# EAGLE board max10adc_v9.02_16chan (EAGLE 9.5.2), part 1 of 3
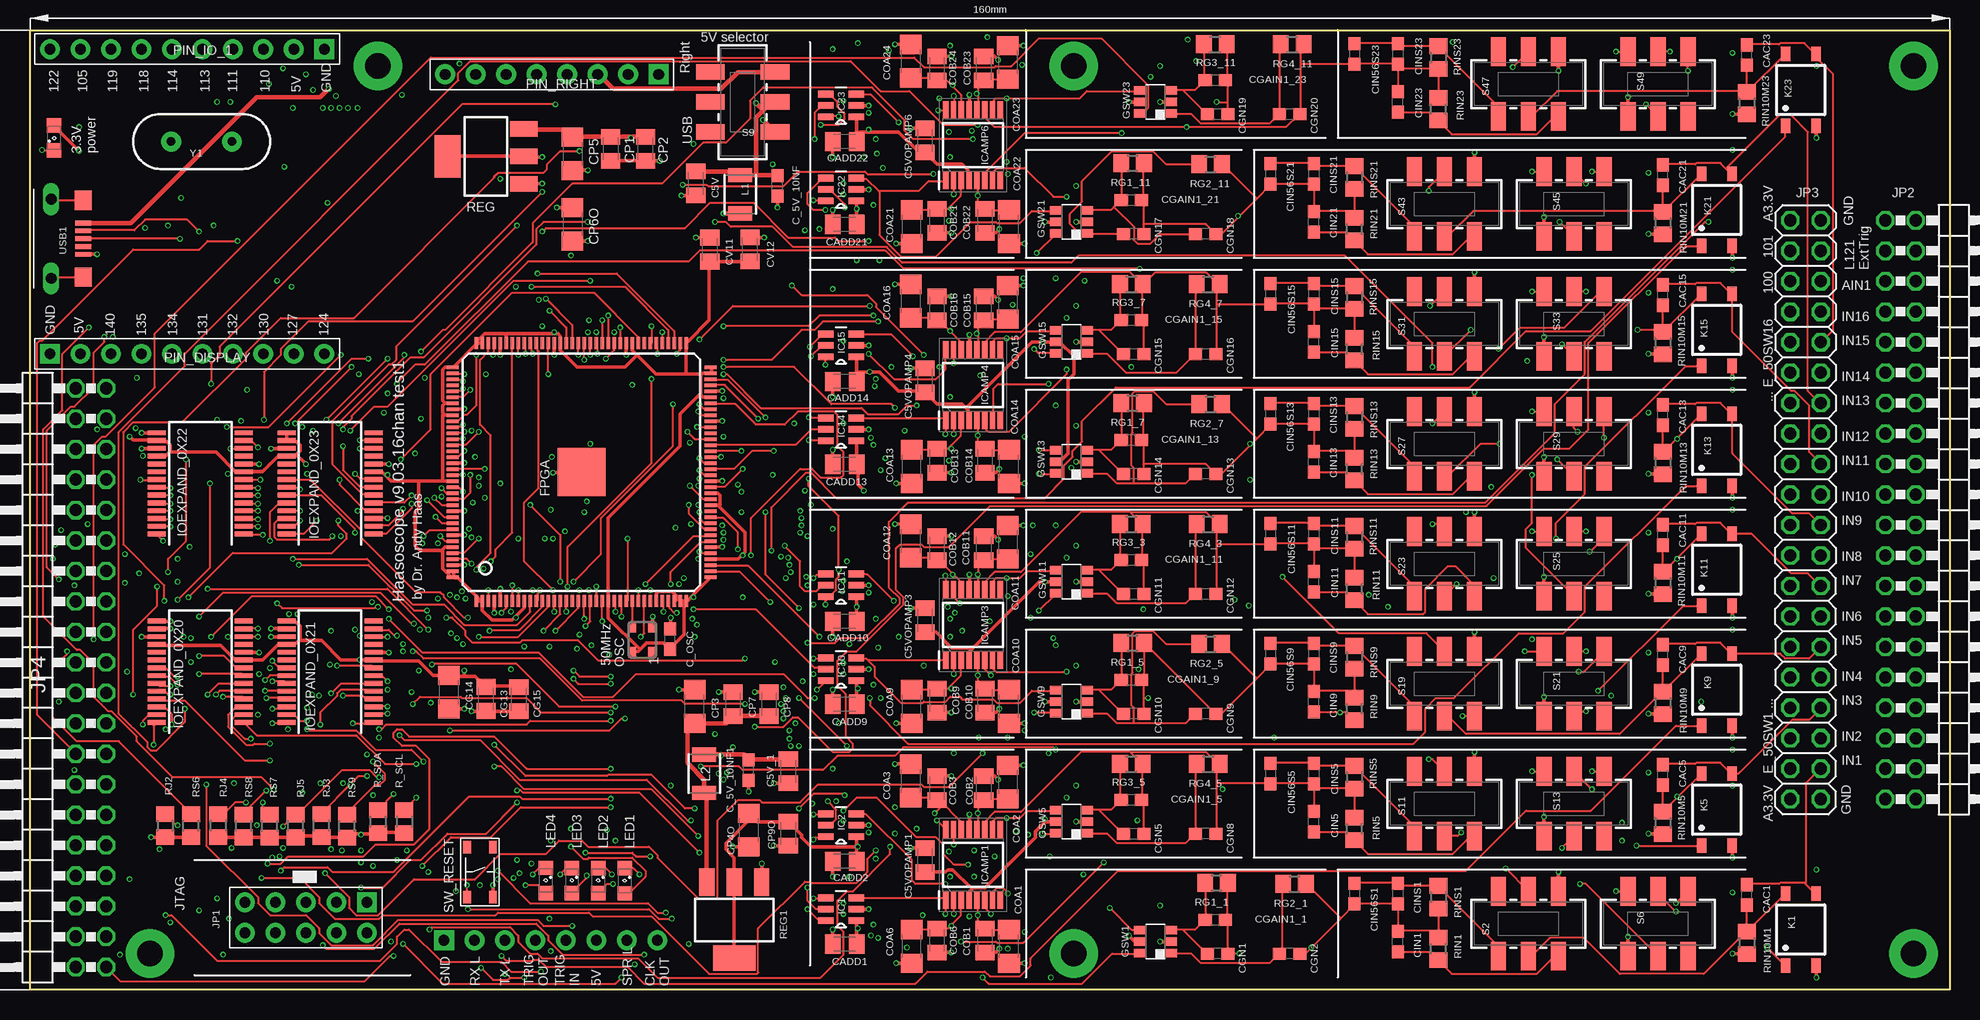
[diagram p6: board, top side]
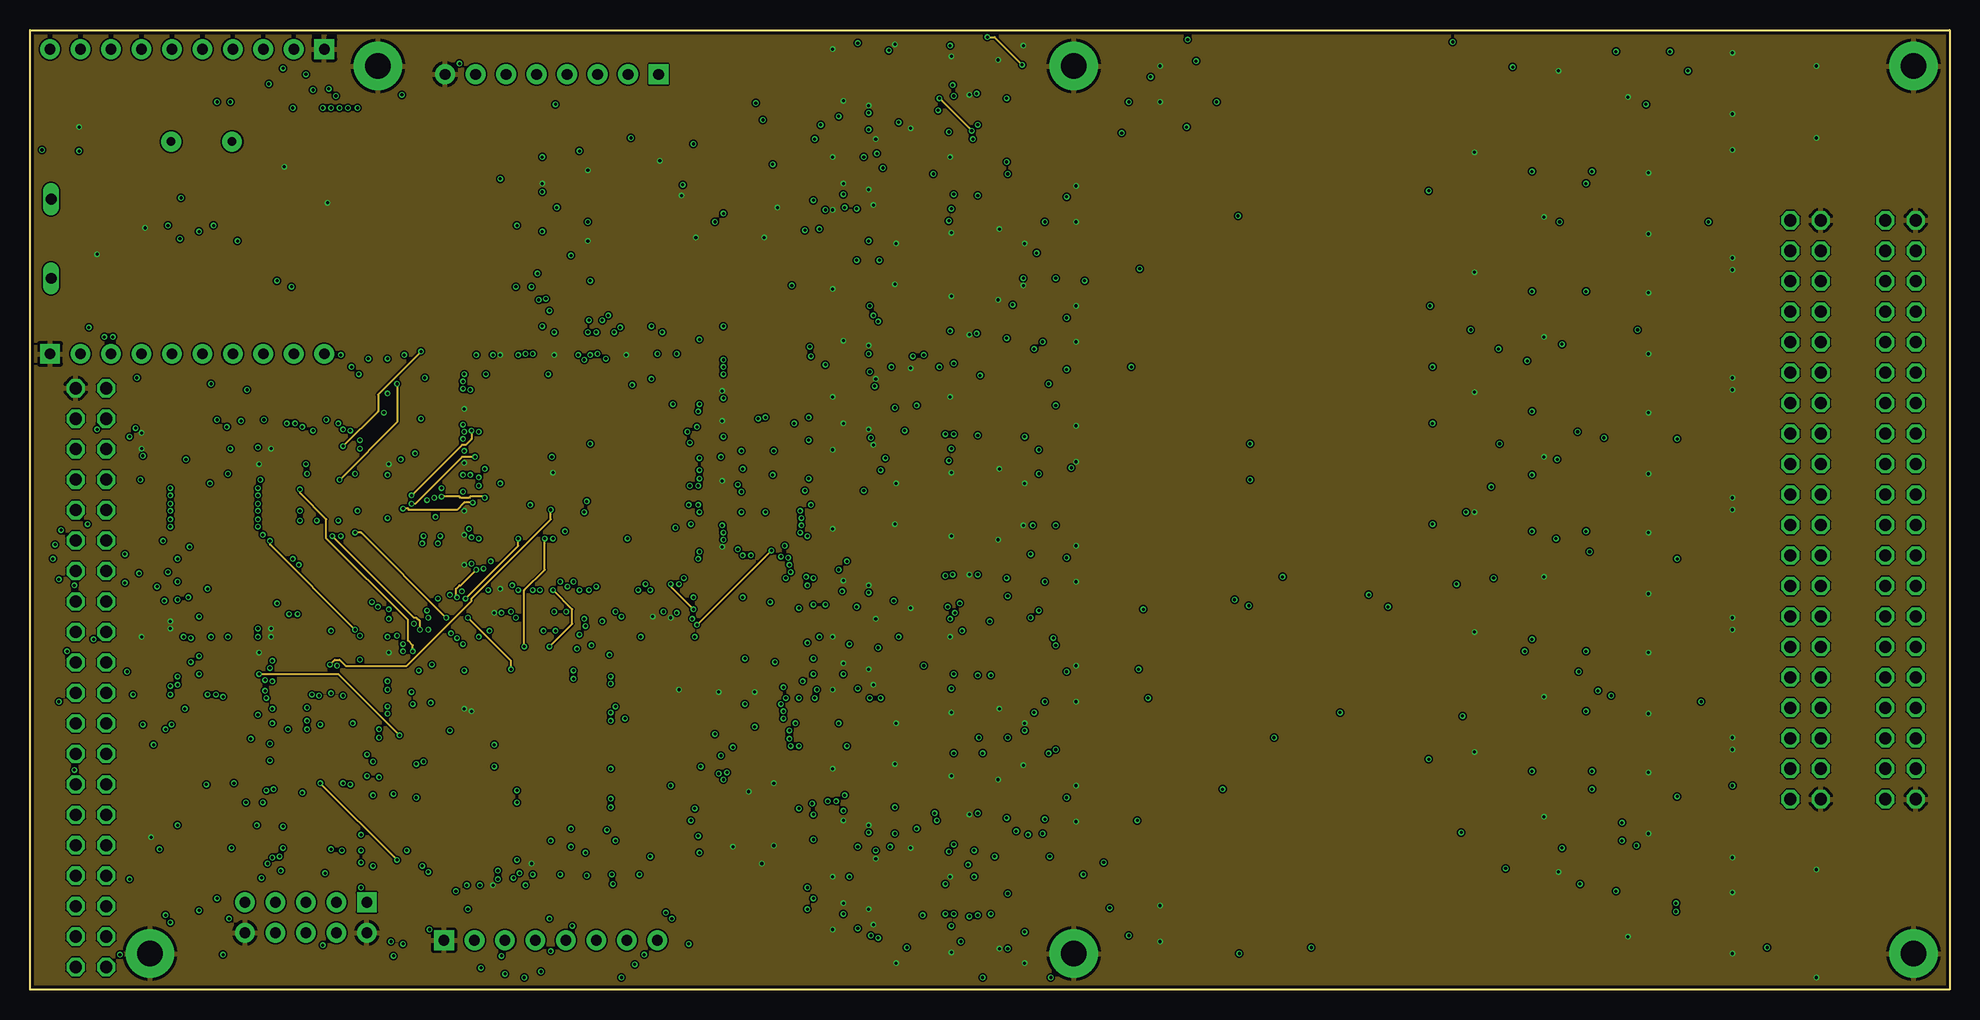
[diagram p7: board, inner layer Route2]
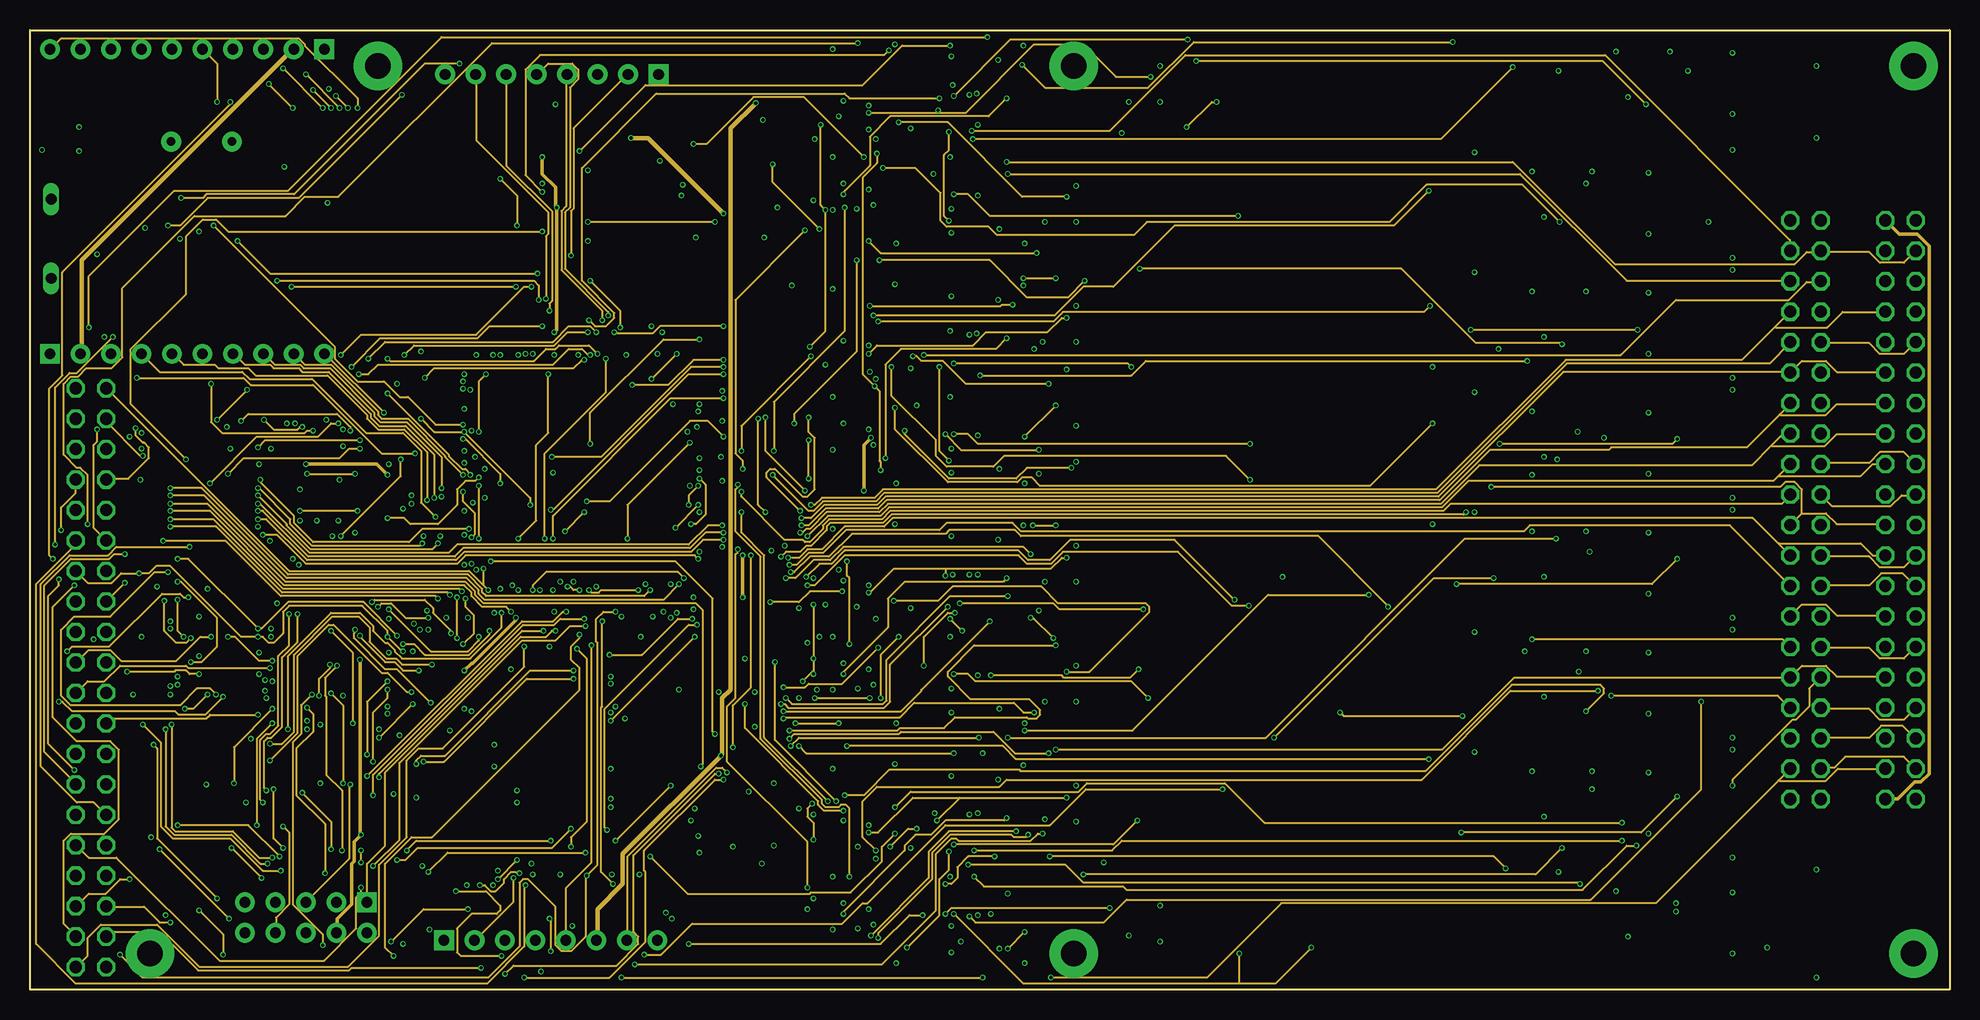
[diagram p8: board, inner layer Route15]
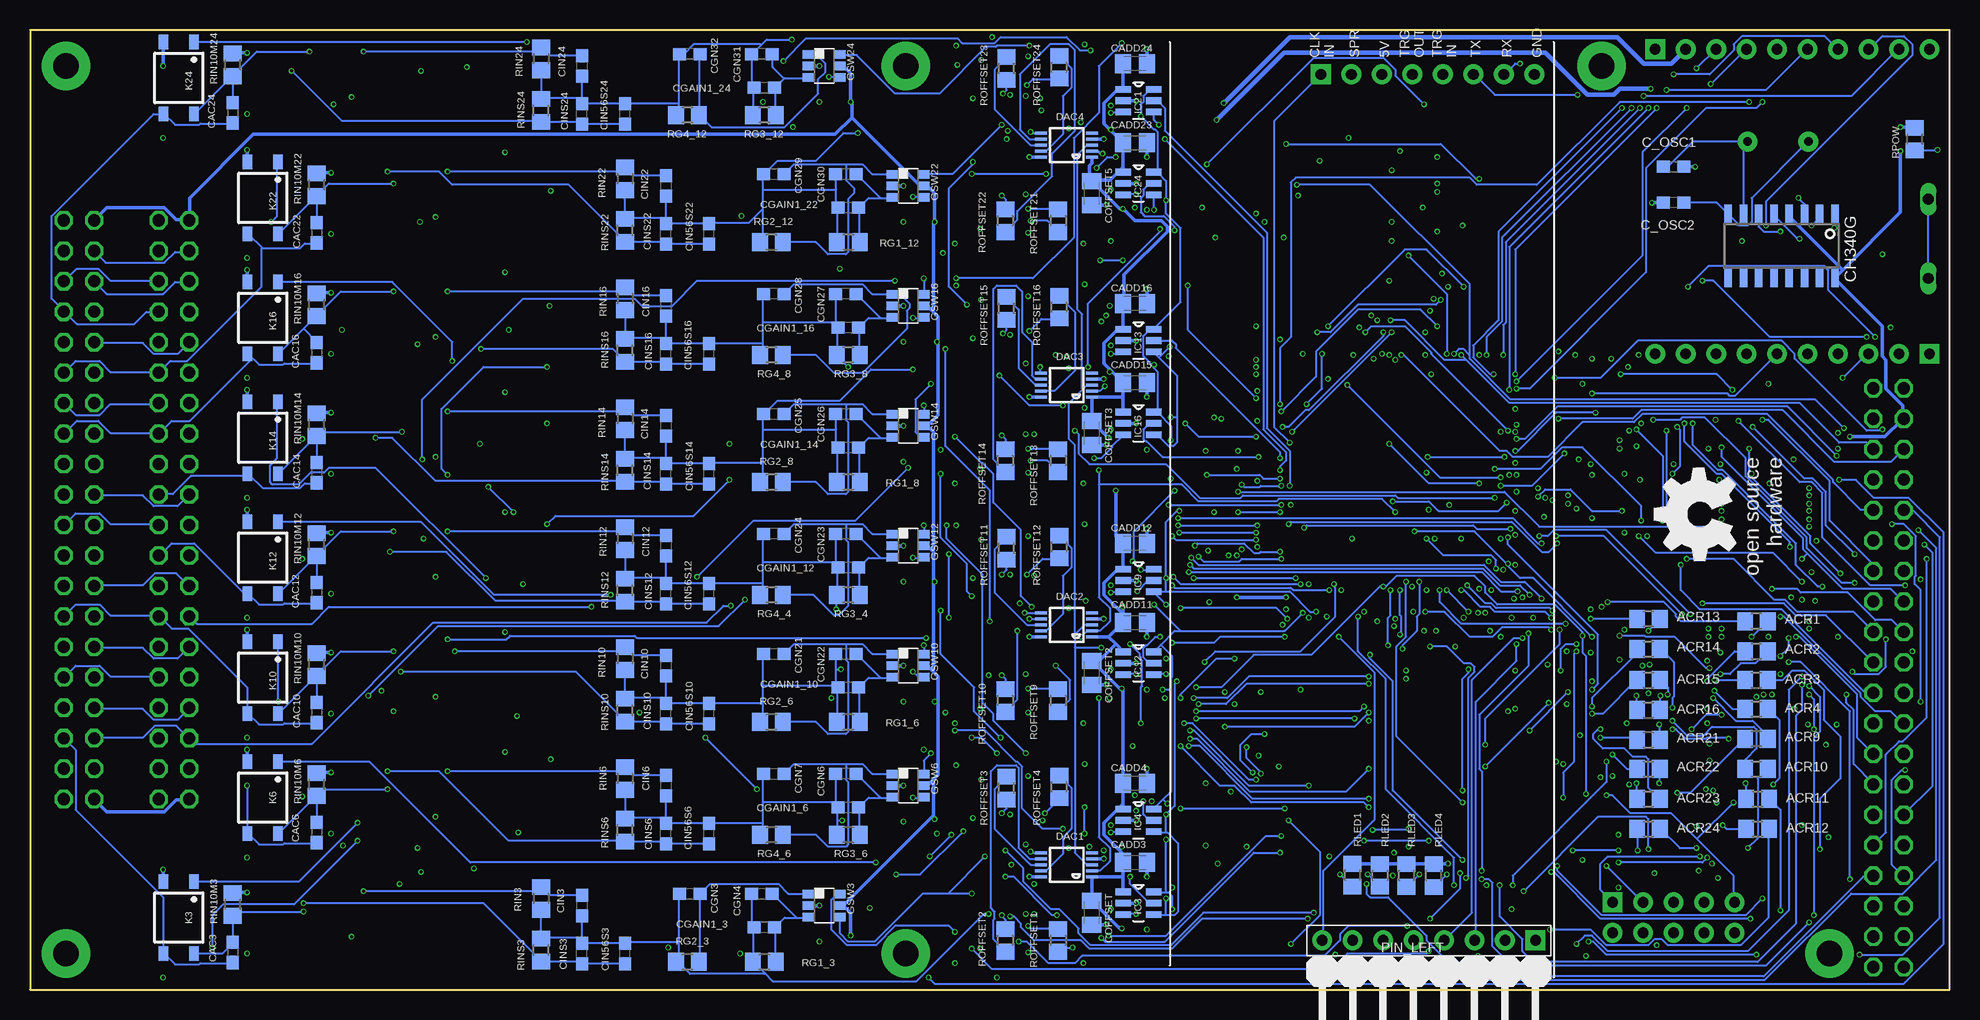
[diagram p9: board, bottom side, seen from below]

Size 160 x 80 mm. Coordinates in mm from the lower left corner, seen from the top.
Outline: 0,0 0,80 160,80 160,0 0,0
Copper layers (1*2*15*16): Top 0.035mm / dielectric 0.23mm / Route2 0.035mm / dielectric 0.93mm / Route15 0.035mm / dielectric 0.23mm / Bottom 0.035mm
Design rules "MF_Standard_4_Layer": minimum track width 5mil, minimum drill 10mil, track to track 5mil, track to pad 5mil, pad to pad 5mil, via to via 5mil, smd to smd 0mil, copper to edge 10mil, drill to drill 10mil, minimum pad ring 4mil, minimum via ring 4mil, stop-mask expansion 2mil, vias tented up to drill 25mil, thermal gap 10mil
Net classes: 0 default: width 0.152 mm; 1 gnd: width 0.305 mm; 2 three: width 0.305 mm; 3 five: width 0.381 mm

## Footprints (pad centres in the part's own frame; a part is rotated, then mirrored left to right if it is on the bottom)
R0805 = smd 1.3 x 1.5: 1 -0.95,0; 2 0.95,0
C0805K = smd 1.3 x 1.6: 1 -1,0; 2 1,0
C0603 = smd 1.1 x 1: 1 -0.85,0; 2 0.85,0
C1206 = smd 1.6 x 1.8: 1 -1.4,0; 2 1.4,0
MSOP10 = smd 0.25 x 1: 1 -1,-2.113; 2 -0.5,-2.113; 3 0,-2.113; 4 0.5,-2.113; 5 1,-2.113; 6 1,2.113; 7 0.5,2.113; 8 0,2.113; 9 -0.5,2.113; 10 -1,2.113
EQFP144 = smd 1 x 0.3: 1 -10.75,8.75; 2 -10.75,8.25; 3 -10.75,7.75; 4 -10.75,7.25; 5 -10.75,6.75; 6 -10.75,6.25; 7 -10.75,5.75; 8 -10.75,5.25; 9 -10.75,4.75; 10 -10.75,4.25; 11 -10.75,3.75; 12 -10.75,3.25; 13 -10.75,2.75; 14 -10.75,2.25; 15 -10.75,1.75; 16 -10.75,1.25; 17 -10.75,0.75; 18 -10.75,0.25; 19 -10.75,-0.25; 20 -10.75,-0.75; 21 -10.75,-1.25; 22 -10.75,-1.75; 23 -10.75,-2.25; 24 -10.75,-2.75; 25 -10.75,-3.25; 26 -10.75,-3.75; 27 -10.75,-4.25; 28 -10.75,-4.75; 29 -10.75,-5.25; 30 -10.75,-5.75; 31 -10.75,-6.25; 32 -10.75,-6.75; 33 -10.75,-7.25; 34 -10.75,-7.75; 35 -10.75,-8.25; 36 -10.75,-8.75; 73 10.75,-8.75; 74 10.75,-8.25; 75 10.75,-7.75; 76 10.75,-7.25; 77 10.75,-6.75; 78 10.75,-6.25; 79 10.75,-5.75; 80 10.75,-5.25; 81 10.75,-4.75; 82 10.75,-4.25; 83 10.75,-3.75; 84 10.75,-3.25; 85 10.75,-2.75; 86 10.75,-2.25; 87 10.75,-1.75; 88 10.75,-1.25; 89 10.75,-0.75; 90 10.75,-0.25; 91 10.75,0.25; 92 10.75,0.75; 93 10.75,1.25; 94 10.75,1.75; 95 10.75,2.25; 96 10.75,2.75; 97 10.75,3.25; 98 10.75,3.75; 99 10.75,4.25; 100 10.75,4.75; 101 10.75,5.25; 102 10.75,5.75; 103 10.75,6.25; 104 10.75,6.75; 105 10.75,7.25; 106 10.75,7.75; 107 10.75,8.25; 108 10.75,8.75 | smd 0.3 x 1: 37 -8.75,-10.75; 38 -8.25,-10.75; 39 -7.75,-10.75; 40 -7.25,-10.75; 41 -6.75,-10.75; 42 -6.25,-10.75; 43 -5.75,-10.75; 44 -5.25,-10.75; 45 -4.75,-10.75; 46 -4.25,-10.75; 47 -3.75,-10.75; 48 -3.25,-10.75; 49 -2.75,-10.75; 50 -2.25,-10.75; 51 -1.75,-10.75; 52 -1.25,-10.75; 53 -0.75,-10.75; 54 -0.25,-10.75; 55 0.25,-10.75; 56 0.75,-10.75; 57 1.25,-10.75; 58 1.75,-10.75; 59 2.25,-10.75; 60 2.75,-10.75; 61 3.25,-10.75; 62 3.75,-10.75; 63 4.25,-10.75; 64 4.75,-10.75; 65 5.25,-10.75; 66 5.75,-10.75; 67 6.25,-10.75; 68 6.75,-10.75; 69 7.25,-10.75; 70 7.75,-10.75; 71 8.25,-10.75; 72 8.75,-10.75; 109 8.75,10.75; 110 8.25,10.75; 111 7.75,10.75; 112 7.25,10.75; 113 6.75,10.75; 114 6.25,10.75; 115 5.75,10.75; 116 5.25,10.75; 117 4.75,10.75; 118 4.25,10.75; 119 3.75,10.75; 120 3.25,10.75; 121 2.75,10.75; 122 2.25,10.75; 123 1.75,10.75; 124 1.25,10.75; 125 0.75,10.75; 126 0.25,10.75; 127 -0.25,10.75; 128 -0.75,10.75; 129 -1.25,10.75; 130 -1.75,10.75; 131 -2.25,10.75; 132 -2.75,10.75; 133 -3.25,10.75; 134 -3.75,10.75; 135 -4.25,10.75; 136 -4.75,10.75; 137 -5.25,10.75; 138 -5.75,10.75; 139 -6.25,10.75; 140 -6.75,10.75; 141 -7.25,10.75; 142 -7.75,10.75; 143 -8.25,10.75; 144 -8.75,10.75 | smd 4 x 4: E 0,0
DBV_R-PDSO-G6 = smd 0.69 x 0.99: 1 -0.95,-1.29; 2 0,-1.29; 3 0.95,-1.29; 4 0.95,1.3; 5 0,1.3; 6 -0.95,1.3
STANDOFF-ELECTRICAL = drill 2.159 pad 4.064: P1 0,0
SOT95P280X145-6N = smd 1.321 x 0.559: 1 -1.27,0.94; 2 -1.27,0; 3 -1.27,-0.94; 4 1.27,-0.94; 5 1.27,0; 6 1.27,0.94
SOP65P640X120-16N = smd 1.475 x 0.45: 1 -2.938,2.275; 2 -2.938,1.625; 3 -2.938,0.975; 4 -2.938,0.325; 5 -2.938,-0.325; 6 -2.938,-0.975; 7 -2.938,-1.625; 8 -2.938,-2.275; 9 2.938,-2.275; 10 2.938,-1.625; 11 2.938,-0.975; 12 2.938,-0.325; 13 2.938,0.325; 14 2.938,0.975; 15 2.938,1.625; 16 2.938,2.275
SSOP28 = smd 0.4 x 1.5: 1 -4.225,-3.625; 2 -3.575,-3.625; 3 -2.925,-3.625; 4 -2.275,-3.625; 5 -1.625,-3.625; 6 -0.975,-3.625; 7 -0.325,-3.625; 8 0.325,-3.625; 9 0.975,-3.625; 10 1.625,-3.625; 11 2.275,-3.625; 12 2.925,-3.625; 13 3.575,-3.625; 14 4.225,-3.625; 15 4.225,3.625; 16 3.575,3.625; 17 2.925,3.625; 18 2.275,3.625; 19 1.625,3.625; 20 0.975,3.625; 21 0.325,3.625; 22 -0.325,3.625; 23 -0.975,3.625; 24 -1.625,3.625; 25 -2.275,3.625; 26 -2.925,3.625; 27 -3.575,3.625; 28 -4.225,3.625
H2X5-2.54 = drill 0.889 pad 1.651 square: 1 -1.27,5.08 | drill 0.889 pad 1.651: 2 -1.27,2.54; 3 -1.27,0; 4 -1.27,-2.54; 5 -1.27,-5.08; 6 1.27,-5.08; 7 1.27,-2.54; 8 1.27,0; 9 1.27,2.54; 10 1.27,5.08
2X20/90 = drill 1.016 octagon: 1 -24.13,-6.35; 2 -24.13,-3.81; 3 -21.59,-6.35; 4 -21.59,-3.81; 5 -19.05,-6.35; 6 -19.05,-3.81; 7 -16.51,-6.35; 8 -16.51,-3.81; 9 -13.97,-6.35; 10 -13.97,-3.81; 11 -11.43,-6.35; 12 -11.43,-3.81; 13 -8.89,-6.35; 14 -8.89,-3.81; 15 -6.35,-6.35; 16 -6.35,-3.81; 17 -3.81,-6.35; 18 -3.81,-3.81; 19 -1.27,-6.35; 20 -1.27,-3.81; 21 1.27,-6.35; 22 1.27,-3.81; 23 3.81,-6.35; 24 3.81,-3.81; 25 6.35,-6.35; 26 6.35,-3.81; 27 8.89,-6.35; 28 8.89,-3.81; 29 11.43,-6.35; 30 11.43,-3.81; 31 13.97,-6.35; 32 13.97,-3.81; 33 16.51,-6.35; 34 16.51,-3.81; 35 19.05,-6.35; 36 19.05,-3.81; 37 21.59,-6.35; 38 21.59,-3.81; 39 24.13,-6.35; 40 24.13,-3.81
2X20 = drill 1.016 octagon: 1 -24.13,-1.27; 2 -24.13,1.27; 3 -21.59,-1.27; 4 -21.59,1.27; 5 -19.05,-1.27; 6 -19.05,1.27; 7 -16.51,-1.27; 8 -16.51,1.27; 9 -13.97,-1.27; 10 -13.97,1.27; 11 -11.43,-1.27; 12 -11.43,1.27; 13 -8.89,-1.27; 14 -8.89,1.27; 15 -6.35,-1.27; 16 -6.35,1.27; 17 -3.81,-1.27; 18 -3.81,1.27; 19 -1.27,-1.27; 20 -1.27,1.27; 21 1.27,-1.27; 22 1.27,1.27; 23 3.81,-1.27; 24 3.81,1.27; 25 6.35,-1.27; 26 6.35,1.27; 27 8.89,-1.27; 28 8.89,1.27; 29 11.43,-1.27; 30 11.43,1.27; 31 13.97,-1.27; 32 13.97,1.27; 33 16.51,-1.27; 34 16.51,1.27; 35 19.05,-1.27; 36 19.05,1.27; 37 21.59,-1.27; 38 21.59,1.27; 39 24.13,-1.27; 40 24.13,1.27
SOP04 = smd 0.8 x 1.2: 1 -1.27,-3; 2 1.27,-3; 3 1.27,3; 4 -1.27,3
1210 = smd 1.2 x 2: 1 -1.6,0; 2 1.6,0
SML0805 = smd 1.2 x 1.2: A 1.05,0; C -1.05,0
ASE = smd 0.9 x 0.65: 1 -1.05,-0.825; 2 1.05,-0.825; 3 1.05,0.825; 4 -1.05,0.825
H10-2.54 = drill 0.889 pad 1.651 square: 1 0,11.43 | drill 0.889 pad 1.651: 2 0,8.89; 3 0,6.35; 4 0,3.81; 5 0,1.27; 6 0,-1.27; 7 0,-3.81; 8 0,-6.35; 9 0,-8.89; 10 0,-11.43
H8-2.54-90D-MALE = drill 0.889 pad 1.651 square: 1 0,8.89 | drill 0.889 pad 1.651: 2 0,6.35; 3 0,3.81; 4 0,1.27; 5 0,-1.27; 6 0,-3.81; 7 0,-6.35; 8 0,-8.89
H8-2.54-90D-FEMALE = drill 0.889 pad 1.651 square: 1 0,8.89 | drill 0.889 pad 1.651: 2 0,6.35; 3 0,3.81; 4 0,1.27; 5 0,-1.27; 6 0,-3.81; 7 0,-6.35; 8 0,-8.89
SOT-223 = smd 1.27 x 2.286: 1 -2.286,-3.175; 2 0,-3.175; 3 2.286,-3.175 | smd 3.556 x 2.159: TER 0,3.175
JS202011SCQN = smd 1.27 x 2.4: 1 -2.5,-2.7; 2 0,-2.7; 3 2.5,-2.7; 4 -2.5,2.7; 5 0,2.7; 6 2.5,2.7
TACT4.2MM = smd 1.05 x 0.65: P$1 -2.075,1.075; P$2 2.075,1.075; P$3 -2.075,-1.075; P$4 2.075,-1.075
SOIC16 = smd 0.635 x 1.524: 1 -4.445,-2.695; 2 -3.175,-2.695; 3 -1.905,-2.695; 4 -0.635,-2.695; 5 0.635,-2.695; 6 1.905,-2.695; 7 3.175,-2.695; 8 4.445,-2.695; 9 4.445,2.695; 10 3.175,2.695; 11 1.905,2.695; 12 0.635,2.695; 13 -0.635,2.695; 14 -1.905,2.695; 15 -3.175,2.695; 16 -4.445,2.695
10118193-0001LF = smd 0.4 x 1.35: 1 -1.3,2.54; 2 -0.65,2.54; 3 0,2.54; 4 0.65,2.54; 5 1.3,2.54 | drill 0.9 long: S1 -3.3,-0.135; S2 3.3,-0.135 | smd 1.6 x 1.4: S3 -3.2,2.54; S4 3.2,2.54
HC49US = drill 0.7 pad 1.651: 1 -2.54,0; 2 2.54,0

## Placement (x,y rotation side)
ACR1  560  [R0805]  16.1,30.7 180 bottom
ACR2  560  [R0805]  16.1,28.2 0 bottom
ACR3  560  [R0805]  16.1,25.8 0 bottom
ACR4  560  [R0805]  16.1,23.4 0 bottom
ACR9  560  [R0805]  16.1,20.9 180 bottom
ACR10  560  [R0805]  16.1,18.4 0 bottom
ACR11  560  [R0805]  16,15.9 0 bottom
ACR12  560  [R0805]  16,13.4 0 bottom
ACR13  560  [R0805]  25.1,30.9 180 bottom
ACR14  560  [R0805]  25.1,28.4 0 bottom
ACR15  560  [R0805]  25.1,25.8 0 bottom
ACR16  560  [R0805]  25.1,23.3 0 bottom
ACR21  560  [R0805]  25.1,20.8 180 bottom
ACR22  560  [R0805]  25.1,18.4 0 bottom
ACR23  560  [R0805]  25.1,15.9 0 bottom
ACR24  560  [R0805]  25.1,13.4 0 bottom
C5V  1uF  [C0805K]  55.5,67.2 90 top
C5V_1  1uF  [C0805K]  63.2,18.2 90 top
C5VOPAMP1  0.1uF  [C0805K]  74.6,10.8 90 top
C5VOPAMP3  0.1uF  [C0805K]  74.6,30.8 90 top
C5VOPAMP4  0.1uF  [C0805K]  74.6,50.8 90 top
C5VOPAMP6  0.1uF  [C0805K]  74.6,70.8 90 top
C_5V_10NF  0.01uF  [C0603]  62.3,67 90 top
C_5V_10NF1  0.01uF  [C0603]  59.9,18.3 90 top
C_OSC  0.01uF  [C0603]  53.36,29.22 90 top
C_OSC1  22pF  [C0603]  23,68.6 0 bottom
C_OSC2  22pF  [C0603]  23,65.6 180 bottom
CAC1  0.01uF  [C0603]  143.1,7.9 90 top
CAC3  0.01uF  [C0603]  143.1,3.1 270 bottom
CAC5  0.01uF  [C0603]  136.1,17.9 90 top
CAC6  0.01uF  [C0603]  136.1,13.1 270 bottom
CAC9  0.01uF  [C0603]  136.1,27.9 90 top
CAC10  0.01uF  [C0603]  136.1,23.1 270 bottom
CAC11  0.01uF  [C0603]  136.1,37.9 90 top
CAC12  0.01uF  [C0603]  136.1,33.1 270 bottom
CAC13  0.01uF  [C0603]  136.1,47.9 90 top
CAC14  0.01uF  [C0603]  136.1,43.1 270 bottom
CAC15  0.01uF  [C0603]  136.1,57.9 90 top
CAC16  0.01uF  [C0603]  136.1,53.1 270 bottom
CAC21  0.01uF  [C0603]  136.1,67.9 90 top
CAC22  0.01uF  [C0603]  136.1,63.1 270 bottom
CAC23  0.01uF  [C0603]  143.1,77.9 90 top
CAC24  0.01uF  [C0603]  143.1,73.1 270 bottom
CADD1  0.1uF  [C0805K]  67.9,3.8 180 top
CADD2  0.1uF  [C0805K]  67.9,10.7 180 top
CADD3  0.1uF  [C0805K]  67.9,10.6 0 bottom
CADD4  0.1uF  [C0805K]  67.9,17.2 0 bottom
CADD9  0.1uF  [C0805K]  67.9,23.8 180 top
CADD10  0.1uF  [C0805K]  67.9,30.7 180 top
CADD11  0.1uF  [C0805K]  67.9,30.6 0 bottom
CADD12  0.1uF  [C0805K]  67.9,37.2 0 bottom
CADD13  0.1uF  [C0805K]  67.9,43.8 180 top
CADD14  0.1uF  [C0805K]  67.9,50.7 180 top
CADD15  0.1uF  [C0805K]  67.9,50.6 0 bottom
CADD16  0.1uF  [C0805K]  67.9,57.2 0 bottom
CADD21  0.1uF  [C0805K]  67.9,63.8 180 top
CADD22  0.1uF  [C0805K]  67.9,70.7 180 top
CADD23  0.1uF  [C0805K]  67.9,70.6 0 bottom
CADD24  0.1uF  [C0805K]  67.9,77.2 0 bottom
CG13  1uF  [C0805K]  38.01,24.23 270 top
CG14  10uF  [C1206]  34.91,24.79 270 top
CG15  0.1uF  [C0805K]  40.75,24.21 270 top
CGAIN1_1  220pF  [C0603]  98.8,5.8 180 top
CGAIN1_3  220pF  [C0603]  98.8,5.2 0 bottom
CGAIN1_5  220pF  [C0603]  91.8,15.8 180 top
CGAIN1_6  220pF  [C0603]  91.8,15.2 0 bottom
CGAIN1_9  220pF  [C0603]  91.8,25.8 180 top
CGAIN1_10  220pF  [C0603]  91.8,25.2 0 bottom
CGAIN1_11  220pF  [C0603]  91.8,35.8 180 top
CGAIN1_12  220pF  [C0603]  91.8,35.2 0 bottom
CGAIN1_13  220pF  [C0603]  91.8,45.8 180 top
CGAIN1_14  220pF  [C0603]  91.8,45.2 0 bottom
CGAIN1_15  220pF  [C0603]  91.8,55.8 180 top
CGAIN1_16  220pF  [C0603]  91.8,55.2 0 bottom
CGAIN1_21  220pF  [C0603]  91.8,65.8 180 top
CGAIN1_22  220pF  [C0603]  91.8,65.2 0 bottom
CGAIN1_23  220pF  [C0603]  98.8,75.8 180 top
CGAIN1_24  220pF  [C0603]  98.8,75.2 0 bottom
CGN1  24pF  [C0603]  99,3 180 top
CGN2  24pF  [C0603]  105,3 180 top
CGN3  24pF  [C0603]  105,8 0 bottom
CGN4  24pF  [C0603]  99,8 0 bottom
CGN5  24pF  [C0603]  92,13 0 top
CGN6  24pF  [C0603]  92,18 180 bottom
CGN7  24pF  [C0603]  98,18 0 bottom
CGN8  24pF  [C0603]  98,13 180 top
CGN9  24pF  [C0603]  98,23 180 top
CGN10  24pF  [C0603]  92,23 180 top
CGN11  24pF  [C0603]  92,33 0 top
CGN12  24pF  [C0603]  98,33 0 top
CGN13  24pF  [C0603]  98,43 180 top
CGN14  24pF  [C0603]  92,43 180 top
CGN15  24pF  [C0603]  92,53 0 top
CGN16  24pF  [C0603]  98,53 0 top
CGN17  24pF  [C0603]  92,63 180 top
CGN18  24pF  [C0603]  98,63 180 top
CGN19  24pF  [C0603]  99,73 0 top
CGN20  24pF  [C0603]  105,73 0 top
CGN21  24pF  [C0603]  98,28 0 bottom
CGN22  24pF  [C0603]  92,28 0 bottom
CGN23  24pF  [C0603]  92,38 180 bottom
CGN24  24pF  [C0603]  98,38 180 bottom
CGN25  24pF  [C0603]  98,48 0 bottom
CGN26  24pF  [C0603]  92,48 0 bottom
CGN27  24pF  [C0603]  92,58 180 bottom
CGN28  24pF  [C0603]  98,58 180 bottom
CGN29  24pF  [C0603]  98,68 0 bottom
CGN30  24pF  [C0603]  92,68 0 bottom
CGN31  24pF  [C0603]  99,78 180 bottom
CGN32  24pF  [C0603]  105,78 180 bottom
CIN1  10pF  [C0603]  114,4 90 top
CIN3  10pF  [C0603]  114,7 270 bottom
CIN5  10pF  [C0603]  107,14 90 top
CIN6  10pF  [C0603]  107,17 270 bottom
CIN9  10pF  [C0603]  107,24 90 top
CIN10  10pF  [C0603]  107,27 270 bottom
CIN11  10pF  [C0603]  107,34 90 top
CIN12  10pF  [C0603]  107,37 270 bottom
CIN13  10pF  [C0603]  107,44 90 top
CIN14  10pF  [C0603]  107,47 270 bottom
CIN15  10pF  [C0603]  107,54 90 top
CIN16  10pF  [C0603]  107,57 270 bottom
CIN21  10pF  [C0603]  107,64 90 top
CIN22  10pF  [C0603]  107,67 270 bottom
CIN23  10pF  [C0603]  114,74 90 top
CIN24  10pF  [C0603]  114,77 270 bottom
CIN56S1  56pF  [C0603]  110.4,8 270 top
CIN56S3  56pF  [C0603]  110.4,3 90 bottom
CIN56S5  56pF  [C0603]  103.4,18 270 top
CIN56S6  56pF  [C0603]  103.4,13 90 bottom
CIN56S9  56pF  [C0603]  103.4,28 270 top
CIN56S10  56pF  [C0603]  103.4,23 90 bottom
CIN56S11  56pF  [C0603]  103.4,38 270 top
CIN56S12  56pF  [C0603]  103.4,33 90 bottom
CIN56S13  56pF  [C0603]  103.4,48 270 top
CIN56S14  56pF  [C0603]  103.4,43 90 bottom
CIN56S15  56pF  [C0603]  103.4,58 270 top
CIN56S16  56pF  [C0603]  103.4,53 90 bottom
CIN56S21  56pF  [C0603]  103.4,68 270 top
CIN56S22  56pF  [C0603]  103.4,63 90 bottom
CIN56S23  56pF  [C0603]  110.4,78 270 top
CIN56S24  56pF  [C0603]  110.4,73 90 bottom
CINS1  1nF  [C0603]  114,8 270 top
CINS3  1nF  [C0603]  114,3 90 bottom
CINS5  1nF  [C0603]  107,18 270 top
CINS6  1nF  [C0603]  107,13 90 bottom
CINS9  1nF  [C0603]  107,28 270 top
CINS10  1nF  [C0603]  107,23 90 bottom
CINS11  1nF  [C0603]  107,38 270 top
CINS12  1nF  [C0603]  107,33 90 bottom
CINS13  1nF  [C0603]  107,48 270 top
CINS14  1nF  [C0603]  107,43 90 bottom
CINS15  1nF  [C0603]  107,58 270 top
CINS16  1nF  [C0603]  107,53 90 bottom
CINS21  1nF  [C0603]  107,68 270 top
CINS22  1nF  [C0603]  107,63 90 bottom
CINS23  1nF  [C0603]  114,78 270 top
CINS24  1nF  [C0603]  114,73 90 bottom
COA1  10uF  [C1206]  81.6,3.6 90 top
COA2  10uF  [C1206]  81.5,17.3 270 top
COA3  10uF  [C1206]  73.4,17.4 270 top
COA6  10uF  [C1206]  73.5,3.6 90 top
COA9  10uF  [C1206]  73.5,23.6 90 top
COA10  10uF  [C1206]  81.6,23.6 90 top
COA11  10uF  [C1206]  81.5,37.3 270 top
COA12  10uF  [C1206]  73.4,37.4 270 top
COA13  10uF  [C1206]  73.5,43.6 90 top
COA14  10uF  [C1206]  81.6,43.6 90 top
COA15  10uF  [C1206]  81.5,57.3 270 top
COA16  10uF  [C1206]  73.4,57.4 270 top
COA21  10uF  [C1206]  73.5,63.6 90 top
COA22  10uF  [C1206]  81.6,63.6 90 top
COA23  10uF  [C1206]  81.5,77.3 270 top
COA24  10uF  [C1206]  73.4,77.4 270 top
COB1  0.1uF  [C0805K]  79.6,4.1 90 top
COB2  0.1uF  [C0805K]  79.5,16.8 270 top
COB3  0.1uF  [C0805K]  75.6,16.8 270 top
COB6  0.1uF  [C0805K]  75.6,4.1 90 top
COB9  0.1uF  [C0805K]  75.6,24.1 90 top
COB10  0.1uF  [C0805K]  79.6,24.1 90 top
COB11  0.1uF  [C0805K]  79.5,36.8 270 top
COB12  0.1uF  [C0805K]  75.6,36.8 270 top
COB13  0.1uF  [C0805K]  75.6,44.1 90 top
COB14  0.1uF  [C0805K]  79.6,44.1 90 top
COB15  0.1uF  [C0805K]  79.5,56.8 270 top
COB16  0.1uF  [C0805K]  75.6,56.8 270 top
COB21  0.1uF  [C0805K]  75.6,64.1 90 top
COB22  0.1uF  [C0805K]  79.6,64.1 90 top
COB23  0.1uF  [C0805K]  79.5,76.8 270 top
COB24  0.1uF  [C0805K]  75.6,76.8 270 top
COFFSET  0.1uF  [C0805K]  71.5,6.4 90 bottom
COFFSET2  0.1uF  [C0805K]  71.5,26.4 90 bottom
COFFSET3  0.1uF  [C0805K]  71.5,46.4 90 bottom
COFFSET5  0.1uF  [C0805K]  71.5,66.4 90 bottom
CP1  1uF  [C0805K]  48.4,70.1 270 top
CP2  0.1uF  [C0805K]  51.3,70.1 270 top
CP3  10uF  [C1206]  55.4,23.6 90 top
CP4O  10uF  [C1206]  59.9,13.3 270 top
CP5  10uF  [C1206]  45.22,69.67 270 top
CP6O  10uF  [C1206]  45.22,63.8 270 top
CP7  1uF  [C0805K]  58.6,23.8 90 top
CP8  0.1uF  [C0805K]  61.6,23.8 90 top
CP9O  1uF  [C0805K]  63.2,13 270 top
CV11  0.1uF  [C0805K]  56.67,61.69 90 top
CV12  1uF  [C0805K]  60.01,61.71 90 top
DAC1  MCP4728  [MSOP10]  73.6,10.4 90 bottom
DAC2  MCP4728  [MSOP10]  73.6,30.4 90 bottom
DAC3  MCP4728  [MSOP10]  73.6,50.4 90 bottom
DAC4  MCP4728  [MSOP10]  73.6,70.4 90 bottom
FPGA  10M08SAE144  [EQFP144]  45.96,43.13 90 top
GOLD_ORB_SM1  OSHWLOGOLOGO8MM  [OSHW_8MM]  20.8,39.6 90 bottom
GSW1  741G3157DBVR  [DBV_R-PDSO-G6]  93.8,4 90 top
GSW3  741G3157DBVR  [DBV_R-PDSO-G6]  93.8,7 270 bottom
GSW5  741G3157DBVR  [DBV_R-PDSO-G6]  86.8,14 90 top
GSW6  741G3157DBVR  [DBV_R-PDSO-G6]  86.8,17 270 bottom
GSW9  741G3157DBVR  [DBV_R-PDSO-G6]  86.8,24 90 top
GSW10  741G3157DBVR  [DBV_R-PDSO-G6]  86.8,27 270 bottom
GSW11  741G3157DBVR  [DBV_R-PDSO-G6]  86.8,34 90 top
GSW12  741G3157DBVR  [DBV_R-PDSO-G6]  86.8,37 270 bottom
GSW13  741G3157DBVR  [DBV_R-PDSO-G6]  86.8,44 90 top
GSW14  741G3157DBVR  [DBV_R-PDSO-G6]  86.8,47 270 bottom
GSW15  741G3157DBVR  [DBV_R-PDSO-G6]  86.8,54 90 top
GSW16  741G3157DBVR  [DBV_R-PDSO-G6]  86.8,57 270 bottom
GSW21  741G3157DBVR  [DBV_R-PDSO-G6]  86.8,64 90 top
GSW22  741G3157DBVR  [DBV_R-PDSO-G6]  86.8,67 270 bottom
GSW23  741G3157DBVR  [DBV_R-PDSO-G6]  93.8,74 90 top
GSW24  741G3157DBVR  [DBV_R-PDSO-G6]  93.8,77 270 bottom
H1  STANDOFF_ELECTRICAL  [STANDOFF-ELECTRICAL]  29,77 0 bottom
H2  STANDOFF_ELECTRICAL  [STANDOFF-ELECTRICAL]  10,3 0 top
H3  STANDOFF_ELECTRICAL  [STANDOFF-ELECTRICAL]  157,77 0 top
H4  STANDOFF_ELECTRICAL  [STANDOFF-ELECTRICAL]  157,3 0 top
H5  STANDOFF_ELECTRICAL  [STANDOFF-ELECTRICAL]  87,77 0 top
H6  STANDOFF_ELECTRICAL  [STANDOFF-ELECTRICAL]  87,3 0 top
IC1  MAX11105AUT+T  [SOT95P280X145-6N]  67.6,6.7 180 top
IC2  MAX11105AUT+T  [SOT95P280X145-6N]  67.6,13.7 180 top
IC3  MAX11105AUT+T  [SOT95P280X145-6N]  67.6,7.2 0 bottom
IC4  MAX11105AUT+T  [SOT95P280X145-6N]  67.6,14.1 0 bottom
IC9  MAX11105AUT+T  [SOT95P280X145-6N]  67.6,34.1 0 bottom
IC10  MAX11105AUT+T  [SOT95P280X145-6N]  67.6,26.7 180 top
IC11  MAX11105AUT+T  [SOT95P280X145-6N]  67.6,33.7 180 top
IC12  MAX11105AUT+T  [SOT95P280X145-6N]  67.6,27.2 0 bottom
IC13  MAX11105AUT+T  [SOT95P280X145-6N]  67.6,54.1 0 bottom
IC14  MAX11105AUT+T  [SOT95P280X145-6N]  67.6,46.7 180 top
IC15  MAX11105AUT+T  [SOT95P280X145-6N]  67.6,53.7 180 top
IC16  MAX11105AUT+T  [SOT95P280X145-6N]  67.6,47.2 0 bottom
IC21  MAX11105AUT+T  [SOT95P280X145-6N]  67.6,74.1 0 bottom
IC22  MAX11105AUT+T  [SOT95P280X145-6N]  67.6,66.7 180 top
IC23  MAX11105AUT+T  [SOT95P280X145-6N]  67.6,73.7 180 top
IC24  MAX11105AUT+T  [SOT95P280X145-6N]  67.6,67.2 0 bottom
ICAMP1  OPA4322AIPWR  [SOP65P640X120-16N]  78.6,10.4 90 top
ICAMP3  OPA4322AIPWR  [SOP65P640X120-16N]  78.6,30.4 90 top
ICAMP4  OPA4322AIPWR  [SOP65P640X120-16N]  78.6,50.4 90 top
ICAMP6  OPA4322AIPWR  [SOP65P640X120-16N]  78.6,70.4 90 top
IOEXPAND_0X20  MCP23017SS  [SSOP28]  14.2,26.5 90 top
IOEXPAND_0X21  MCP23017SS  [SSOP28]  25,26.5 90 top
IOEXPAND_0X22  MCP23017SS  [SSOP28]  14.2,42.2 90 top
IOEXPAND_0X23  MCP23017SS  [SSOP28]  25,42.2 90 top
JP1  2x5p-2.54  [H2X5-2.54]  23,6 270 top
JP2  [2X20/90]  161,40 270 top
JP3  [2X20]  148,40 270 top
JP4  [2X20/90]  0,26 90 top
K1  AQY21SOP  [SOP04]  147.6,5 0 top
K3  AQY21SOP  [SOP04]  147.6,6 180 bottom
K5  AQY21SOP  [SOP04]  140.6,15 0 top
K6  AQY21SOP  [SOP04]  140.6,16 180 bottom
K9  AQY21SOP  [SOP04]  140.6,25 0 top
K10  AQY21SOP  [SOP04]  140.6,26 180 bottom
K11  AQY21SOP  [SOP04]  140.6,35 0 top
K12  AQY21SOP  [SOP04]  140.6,36 180 bottom
K13  AQY21SOP  [SOP04]  140.6,45 0 top
K14  AQY21SOP  [SOP04]  140.6,46 180 bottom
K15  AQY21SOP  [SOP04]  140.6,55 0 top
K16  AQY21SOP  [SOP04]  140.6,56 180 bottom
K21  AQY21SOP  [SOP04]  140.6,65 0 top
K22  AQY21SOP  [SOP04]  140.6,66 180 bottom
K23  AQY21SOP  [SOP04]  147.6,75 0 top
K24  AQY21SOP  [SOP04]  147.6,76 180 bottom
L1  10uH  [1210]  59.2,66.3 270 top
L2  10uH  [1210]  56.2,18 270 top
LED1  MF-LED-0805-RED  [SML0805]  49.58,9.07 270 top
LED2  MF-LED-0805-RED  [SML0805]  47.38,9.08 270 top
LED3  MF-LED-0805-RED  [SML0805]  45.18,9.09 270 top
LED4  MF-LED-0805-RED  [SML0805]  43,9.1 270 top
LEDPOW  MF-LED-0805-RED  [SML0805]  2,71 90 top
OSC  ASE-50.000MHZ-ET  [ASE]  51.04,29.16 90 top
PIN_DISPLAY  YELLOW-10P-2.54  [H10-2.54]  13.1,53 90 top
PIN_IO_1  YELLOW-10P-2.54  [H10-2.54]  13.1,78.4 270 top
PIN_LEFT  8p-2.54-90d  [H8-2.54-90D-MALE]  43.4,4.1 270 bottom
PIN_RIGHT  8p-2.54-90d  [H8-2.54-90D-FEMALE]  43.5,76.3 270 top
R_SCL  10K  [R0805]  31.2,14 270 top
R_SDA  10K  [R0805]  29,14 270 top
REG  LDL1117S33R  [SOT-223]  37.99,69.46 90 top
REG1  LDL1117S33R  [SOT-223]  58.7,5.8 180 top
RG1_1  47k  [R0805]  98.9,8.9 0 top
RG1_3  47k  [R0805]  98.8,2.3 180 bottom
RG1_5  47k  [R0805]  91.9,28.9 0 top
RG1_6  47k  [R0805]  91.8,22.3 180 bottom
RG1_7  47k  [R0805]  91.9,48.9 0 top
RG1_8  47k  [R0805]  91.8,42.3 180 bottom
RG1_11  47k  [R0805]  91.9,68.9 0 top
RG1_12  47k  [R0805]  91.8,62.3 180 bottom
RG2_1  470k  [R0805]  105.4,8.8 0 top
RG2_3  470k  [R0805]  105.2,2.3 180 bottom
RG2_5  470k  [R0805]  98.4,28.8 0 top
RG2_6  470k  [R0805]  98.2,22.3 180 bottom
RG2_7  470k  [R0805]  98.4,48.8 0 top
RG2_8  470k  [R0805]  98.2,42.3 180 bottom
RG2_11  470k  [R0805]  98.4,68.8 0 top
RG2_12  470k  [R0805]  98.2,62.3 180 bottom
RG3_3  47k  [R0805]  91.8,38.8 0 top
RG3_4  47k  [R0805]  91.8,32.9 180 bottom
RG3_5  47k  [R0805]  91.8,18.8 0 top
RG3_6  47k  [R0805]  91.8,12.9 180 bottom
RG3_7  47k  [R0805]  91.8,58.8 0 top
RG3_8  47k  [R0805]  91.8,52.9 180 bottom
RG3_11  47k  [R0805]  98.8,78.8 0 top
RG3_12  47k  [R0805]  98.8,72.9 180 bottom
RG4_3  470k  [R0805]  98.2,38.8 0 top
RG4_4  470k  [R0805]  98.2,32.9 180 bottom
RG4_5  470k  [R0805]  98.2,18.8 0 top
RG4_6  470k  [R0805]  98.2,12.9 180 bottom
RG4_7  470k  [R0805]  98.2,58.8 0 top
RG4_8  470k  [R0805]  98.2,52.9 180 bottom
RG4_11  470k  [R0805]  105.2,78.8 0 top
RG4_12  470k  [R0805]  105.2,72.9 180 bottom
RIN1  1.1M  [R0805]  117.4,3.4 90 top
RIN3  1.1M  [R0805]  117.4,7.6 270 bottom
RIN5  1.1M  [R0805]  110.4,13.4 90 top
RIN6  1.1M  [R0805]  110.4,17.6 270 bottom
RIN9  1.1M  [R0805]  110.4,23.4 90 top
RIN10  1.1M  [R0805]  110.4,27.6 270 bottom
RIN10M1  10M  [R0805]  143.1,3.9 270 top
RIN10M3  10M  [R0805]  143.1,7.1 90 bottom
RIN10M5  10M  [R0805]  136.1,13.9 270 top
RIN10M6  10M  [R0805]  136.1,17.1 90 bottom
RIN10M9  10M  [R0805]  136.1,23.9 270 top
RIN10M10  10M  [R0805]  136.1,27.1 90 bottom
RIN10M11  10M  [R0805]  136.1,33.9 270 top
RIN10M12  10M  [R0805]  136.1,37.1 90 bottom
RIN10M13  10M  [R0805]  136.1,43.9 270 top
RIN10M14  10M  [R0805]  136.1,47.1 90 bottom
RIN10M15  10M  [R0805]  136.1,53.9 270 top
RIN10M16  10M  [R0805]  136.1,57.1 90 bottom
RIN10M21  10M  [R0805]  136.1,63.9 270 top
RIN10M22  10M  [R0805]  136.1,67.1 90 bottom
RIN10M23  10M  [R0805]  143.1,73.9 270 top
RIN10M24  10M  [R0805]  143.1,77.1 90 bottom
RIN11  1.1M  [R0805]  110.4,33.4 90 top
RIN12  1.1M  [R0805]  110.4,37.6 270 bottom
RIN13  1.1M  [R0805]  110.4,43.4 90 top
RIN14  1.1M  [R0805]  110.4,47.6 270 bottom
RIN15  1.1M  [R0805]  110.4,53.4 90 top
RIN16  1.1M  [R0805]  110.4,57.6 270 bottom
RIN21  1.1M  [R0805]  110.4,63.4 90 top
RIN22  1.1M  [R0805]  110.4,67.6 270 bottom
RIN23  1.1M  [R0805]  117.4,73.4 90 top
RIN24  1.1M  [R0805]  117.4,77.6 270 bottom
RINS1  11K  [R0805]  117.4,7.7 270 top
RINS3  11K  [R0805]  117.4,3.3 90 bottom
RINS5  11K  [R0805]  110.4,17.7 270 top
RINS6  11K  [R0805]  110.4,13.3 90 bottom
RINS9  11K  [R0805]  110.4,27.7 270 top
RINS10  11K  [R0805]  110.4,23.3 90 bottom
RINS11  11K  [R0805]  110.4,37.7 270 top
RINS12  11K  [R0805]  110.4,33.3 90 bottom
RINS13  11K  [R0805]  110.4,47.7 270 top
RINS14  11K  [R0805]  110.4,43.3 90 bottom
RINS15  11K  [R0805]  110.4,57.7 270 top
RINS16  11K  [R0805]  110.4,53.3 90 bottom
RINS21  11K  [R0805]  110.4,67.7 270 top
RINS22  11K  [R0805]  110.4,63.3 90 bottom
RINS23  11K  [R0805]  117.4,77.7 270 top
RINS24  11K  [R0805]  117.4,73.3 90 bottom
RJ2  10K  [R0805]  11.26,13.67 270 top
RJ3  10K  [R0805]  24.3,13.66 90 top
RJ4  10K  [R0805]  15.7,13.67 90 top
RJ5  10K  [R0805]  22.14,13.64 90 top
RLED1  560  [R0805]  49.76,9.53 90 bottom
RLED2  560  [R0805]  47.46,9.52 90 bottom
RLED3  560  [R0805]  45.26,9.51 90 bottom
RLED4  560  [R0805]  43,9.5 90 bottom
ROFFSET1  200  [R0805]  74.3,4.1 270 bottom
ROFFSET2  200  [R0805]  78.7,4.1 270 bottom
ROFFSET3  200  [R0805]  78.6,16.8 90 bottom
ROFFSET4  200  [R0805]  74.2,16.9 90 bottom
ROFFSET9  200  [R0805]  74.3,24.1 270 bottom
ROFFSET10  200  [R0805]  78.7,24.1 270 bottom
ROFFSET11  200  [R0805]  78.6,36.8 90 bottom
ROFFSET12  200  [R0805]  74.2,36.9 90 bottom
ROFFSET13  200  [R0805]  74.3,44.1 270 bottom
ROFFSET14  200  [R0805]  78.7,44.1 270 bottom
ROFFSET15  200  [R0805]  78.6,56.8 90 bottom
ROFFSET16  200  [R0805]  74.2,56.9 90 bottom
ROFFSET21  200  [R0805]  74.3,64.1 270 bottom
ROFFSET22  200  [R0805]  78.7,64.1 270 bottom
ROFFSET23  200  [R0805]  78.6,76.8 90 bottom
ROFFSET24  200  [R0805]  74.2,76.9 90 bottom
RPOW  560  [R0805]  2.9,70.9 90 bottom
RS6  10K  [R0805]  13.42,13.66 90 top
RS7  10K  [R0805]  19.98,13.63 90 top
RS8  10K  [R0805]  17.82,13.64 90 top
RS9  10K  [R0805]  26.42,13.63 90 top
S2  JS202011SCQN  [JS202011SCQN]  124.9,5.5 0 top
S6  JS202011SCQN  [JS202011SCQN]  135.7,5.5 180 top
S9  JS202011SCQN  [JS202011SCQN]  59.4,74 90 top
S11  JS202011SCQN  [JS202011SCQN]  117.9,15.5 0 top
S13  JS202011SCQN  [JS202011SCQN]  128.7,15.5 180 top
S19  JS202011SCQN  [JS202011SCQN]  117.9,25.5 0 top
S21  JS202011SCQN  [JS202011SCQN]  128.7,25.5 180 top
S23  JS202011SCQN  [JS202011SCQN]  117.9,35.5 0 top
S25  JS202011SCQN  [JS202011SCQN]  128.7,35.5 180 top
S27  JS202011SCQN  [JS202011SCQN]  117.9,45.5 0 top
S29  JS202011SCQN  [JS202011SCQN]  128.7,45.5 180 top
S31  JS202011SCQN  [JS202011SCQN]  117.9,55.5 0 top
S33  JS202011SCQN  [JS202011SCQN]  128.7,55.5 180 top
S43  JS202011SCQN  [JS202011SCQN]  117.9,65.5 0 top
S45  JS202011SCQN  [JS202011SCQN]  128.7,65.5 180 top
S47  JS202011SCQN  [JS202011SCQN]  124.9,75.5 0 top
S49  JS202011SCQN  [JS202011SCQN]  135.7,75.5 180 top
SW_RESET  MF-SW-TACT-4.2MM  [TACT4.2MM]  37.5,9.8 270 top
U340G  CH340G  [SOIC16]  14,62 180 bottom
USB1  MF-CON-MICROUSB-RIGHT  [10118193-0001LF]  1.9,62.6 270 top
Y1  ABL-12.000MHZ-B2  [HC49US]  14.3,70.7 180 top

## Tracks (layer width: path | path; a pad name or v marks a point on that pad's centre or on a via)
5VC3
  Top 0.381: CP8.1 CP7.1 58,22.2 CP3.1 54.8,21.6 54.8,18.9 56.2,17.5 L2.2 56.4,16.2 56.4,9 REG1.3
5VC5  (via drill 0.25)
  Top 0.381: CP2.1 50.1,71.1 | 50.1,71.1 CP1.1 45.3,71.1 CP5.1 45.1,71.2 44.6,71.7 41.2,71.7 REG.3 | v57.8,64.7 L1.2 | v50.1,71 50.1,71.1
  Route15 0.381: v57.8,64.7 51.5,71 v50.1,71
5VINFROMRIGHT
  Top 0.381: S9.3 59,76.5 57.6,75.1 48.6,75.1 47.4,76.3 PIN_RIGHT.3
5VINFROMUSB  (via drill 0.25)
  Top 0.381: USB1.1 8.4,63.9 18.9,74.4 24.2,74.4 v24.9,75.1 | S9.1 v61.1,72.5
  Bottom 0.381: v24.9,75.1 27.5,75.1 28,74.6 30.2,74.6 33.7,78.1 55.5,78.1 v61.1,72.5
+3V3  (via drill 0.25)
  Top 0.305: R_SCL.2 31.2,13.1 29,13.1 R_SDA.2 28.9,13 27.6,13 | RJ4.1 15.7,12.7 17.7,12.7 RS8.1 17.9,12.7 19.9,12.7 RS7.1 20.1,12.7 22.1,12.7 RJ5.1 22.2,12.8 24.3,12.8 RJ3.1 24.4,12.7 26.4,12.7 RS9.1 26.5,12.8 26.7,13 27.6,13 | v27.6,12.9 27.6,13 | CG15.1 40.7,25.3 38.1,25.3 CG13.1 37.9,25.3 37.1,26.1 36.2,26.1 | 36.2,26.1 35,26.1 CG14.1 34.8,26.2 33.6,26.2 32.4,27.4 28.7,27.4 IOEXPAND_0X21.9 28.6,27.5 v27.5,27.5 25.9,27.5 24.3,29.1 22.6,29.1 22.5,29.2 | IOEXPAND_0X20.18 10.6,28.7 15.9,28.7 17.1,27.5 17.7,27.5 IOEXPAND_0X20.9 17.9,27.5 19.4,27.5 20.6,28.7 21.3,28.7 IOEXPAND_0X21.18 21.5,28.8 22.1,28.8 22.5,29.2 | 22.5,29.2 22.5,30.3 22.1,30.7 21.4,30.7 IOEXPAND_0X21.15 | 11.7,44.9 11.3,44.5 10.6,44.5 IOEXPAND_0X22.18 | 11.7,44.9 11.7,45.4 11.4,45.7 10.6,45.7 IOEXPAND_0X22.16 10.5,45.8 8.6,45.8 v8.3,46.1 | IOEXPAND_0X23.15 21.4,46.4 21.4,45.8 IOEXPAND_0X23.16 21.5,45.7 22.2,45.7 22.5,45.4 22.5,44.9 22.2,44.6 | 22.2,44.6 22.1,44.5 21.5,44.5 IOEXPAND_0X23.18 21.3,44.4 20.6,44.4 19.4,43.2 17.9,43.2 IOEXPAND_0X22.9 17.7,43.2 17.1,43.2 15.5,44.8 11.8,44.8 11.7,44.9 | v4.1,69.9 2,72 LEDPOW.A | 59.35,36.25 59.6,36.5 59.6,38.1 57.4,40.3 | 59.35,36.25 59,35.9 56.8,35.9 FPGA.40 | 57.4,40.3 57.3,40.4 56.8,40.4 FPGA.49 | FPGA.51 56.8,41.4 57.3,41.4 57.5,41.2 57.5,40.4 57.4,40.3 | 54.3,32.4 54.05,32.65 | 54.05,32.65 53.5,33.2 52.4,33.2 52.2,33 52.2,32.4 FPGA.31 | 54.3,32.4 FPGA.35 | 54.05,32.65 53.8,32.4 FPGA.34 | 54.5,32.4 54.7,32.4 FPGA.36 54.8,32.4 55.2,32.8 | 54.5,32.4 54.3,32.4 | 55.2,32.8 56.7,34.3 FPGA.37 | 50.85,28.35 51.4,28.9 52.8,28.9 53.3,28.4 C_OSC.1 53.4,28.5 54.5,29.6 54.5,32.4
  Top 0.305: 50.85,28.35 50.7,28.2 50.3,28.2 OSC.4 | 50.85,28.35 48.2,31 48.2,32.3 FPGA.23 48.2,32.5 48.2,39.3 54.2,45.3 54.2,48 55.8,49.6 55.9,49.6 | v59.4,36.2 59.35,36.25 | v55.3,32.7 55.2,32.8 | CV12.1 56.7,60.7 CV11.1 56.6,60.6 56.6,55.8 54.8,54 FPGA.73 54.7,53.8 54.7,51.3 | 55.9,49.6 56.1,49.4 56.7,49.4 FPGA.67 | 55.9,51.2 55.9,49.6 | 55.9,51.2 56.1,51.4 56.7,51.4 FPGA.71 56.8,51.5 56.8,51.8 FPGA.72 | 50.6,52.9 52.2,51.3 54.7,51.3 | 50.6,52.9 50.2,53.3 50.2,53.8 FPGA.82 | 54.7,51.3 55.8,51.3 55.9,51.2 | REG.TER 34.9,69.5 41.1,69.5 REG.2 41.3,69.4 v42.7,69.4 | FPGA.144 35.3,34.4 35.3,34.8 FPGA.143 | 34.4,36.7 34.6,36.9 35.2,36.9 FPGA.139 | 34.4,36.7 34.4,35.1 35.1,34.4 FPGA.144 | 37.5,32.4 37.7,32.4 FPGA.2 37.7,32.3 37.7,31.6 38.5,30.8 40.2,30.8 40.45,31.05 | 37.5,32.4 37.3,32.4 FPGA.1 | 40.45,31.05 41.2,31.8 41.2,32.3 FPGA.9 | FPGA.144 35.4,34.3 35.7,34.3 37.5,32.5 37.5,32.4 | 32.4,42.4 30.1,42.4 29.7,42.8 | 32.4,42.4 34.4,42.4 | 34.4,42.4 35.2,42.4 FPGA.128 | 29.7,42.8 29.4,43.1 28.7,43.1 IOEXPAND_0X23.9 | 34.5,48 34.4,48.1 34.4,48.7 34.6,48.9 | 34.5,48 34.6,47.9 35.2,47.9 FPGA.117 | 34.6,48.9 35.2,48.9 FPGA.115 | FPGA.108 37.2,53.8 35.3,51.9 FPGA.109 35.1,51.9 34.6,51.9 34.4,51.7 34.4,49.1 34.6,48.9 | FPGA.107 37.7,53.9 37.3,53.9 FPGA.108 | 39.6,54.6 39.5,54.7 37.9,54.7 37.2,54 FPGA.108 | 39.6,54.6 39.7,54.5 39.7,53.9 FPGA.103 | 43.7,54.7 39.7,54.7 39.6,54.6 | 43.7,54.7 44,54.7 44.2,54.5 44.2,53.9 FPGA.94 44.2,53.8 44.2,53.3 45.6,51.9 49.6,51.9 50.6,52.9 | v43.9,65.2 CP6O.1 | v43.7,54.8 43.7,54.7 | 34.4,42.4 34.4,47.9 34.5,48 | 32.4,42.4 32.4,40.1 32.1,39.8 32.1,37 32.5,36.6 34.3,36.6 34.4,36.7
  Top 0.305: v23,43.8 22.2,44.6 | v29.8,42.9 29.7,42.8 | v36.2,26.6 36.2,26.1 | v40.5,31 40.45,31.05
  Route15 0.305: JP1.9 25.6,4.8 25.6,5.9 26.8,7.1 26.8,10.5 27,10.7 27,12.3 v27.6,12.9 27.5,13 v27.5,27.5 | v59.4,32.7 v59.4,36.2 | v43.7,54.8 43.9,55 v43.9,65.2 43.8,65.3 43.8,66.9 42.7,68 v42.7,69.4 | v23,43.8 28.9,43.8 v29.8,42.9 | v36.2,26.6 36.8,27.2 36.9,27.2 40.5,30.8 v40.5,31
  Bottom 0.305: v4.1,69.9 4.1,64.8 8.9,60 | 8.9,60 9.5,59.4 U340G.16 9.5,59.2 5.6,55.3 5.6,52.8 5.3,52.5 5.3,50.1 3.9,48.7 3.9,47.6 JP4.38 4,47.5 5.4,46.1 v8.3,46.1 | 8.9,60 13.3,64.4 13.3,64.6 U340G.4 | v55.3,32.7 v59.4,32.7
+5V  (via drill 0.25)
  Top 0.381: C5V_1.2 59.9,19.2 C_5V_10NF1.2 59.8,19.3 59.5,19.6 57.6,19.6 | 57.6,19.6 L2.1 | v57.6,19.5 57.6,19.6 | 60.5,67.9 L1.1 58.9,68.2 C5V.2 | 60.5,67.9 62.3,67.9 C_5V_10NF.2 | 60.5,67.9 60.5,72.7 61.8,74 S9.2 61,73.4 v60.5,73.9
  Route15 0.381: PIN_LEFT.6 47.3,4.1 47.3,6.7 49.4,8.8 49.4,11.3 v57.6,19.5 57.7,19.6 57.7,24.3 58.4,25 58.4,71.8 v60.5,73.9 | PIN_DISPLAY.2 4.3,53 4.3,60.8 21.9,78.4 PIN_IO_1.2
  Bottom 0.381: v60.5,73.9 55,79.4 27.7,79.4 25.5,77.2 23.2,77.2 PIN_IO_1.2
A6  (via drill 0.25)
  Top 0.152: v39.3,31.4 39.7,31.8 39.7,32.3 FPGA.6
  Route15 0.152: v39.3,31.4 39.3,30.2 36.7,27.6 31,27.6 30.4,28.2 30.4,28.3 29.8,28.9 29.6,28.9 28.6,29.9 28.6,30.3 27.5,31.4 25.1,31.4 21.5,27.8 v21.5,21.7 | v19,22.9 15,22.9 14.7,22.6 6.8,22.6 6.4,22.2 JP4.17
  Bottom 0.152: v21.5,21.7 20.3,22.9 v19,22.9
A7  (via drill 0.25)
  Top 0.152: v40.2,33.7 40.2,32.4 FPGA.7 | v33.1,31.6 32,31.6 28.2,35.4 v22.4,35.4
  Bottom 0.152: v40.2,33.7 38.7,32.2 38.2,32.2 37.8,31.8 33.3,31.8 v33.1,31.6 | v22.4,35.4 22.4,33.3 20.8,31.7 14,31.7 7.1,24.8 6.4,24.8 JP4.19
A8  (via drill 0.25)
  Top 0.152: v40.7,33.3 40.7,32.4 FPGA.8 | v29,31.9 28.8,31.9 28.7,31.8 21,31.8 v20.6,32.2
  Route15 0.152: v33.2,31 31.3,31 30.1,32.2 29.3,32.2 v29,31.9
  Bottom 0.152: v40.7,33.3 40.5,33.3 39.1,31.9 38.3,31.9 37.9,31.5 33.7,31.5 v33.2,31 | v20.6,32.2 13.8,32.2 12.8,31.2 10.3,31.2 6.4,27.3 JP4.21
A10  (via drill 0.25)
  Top 0.152: v21.9,35.9 28.1,35.9 31.9,32.1 34.5,32.1 36.2,30.4 40.6,30.4 41.7,31.5 41.7,32.3 FPGA.10
  Bottom 0.152: v21.9,35.9 18,35.9 14.6,32.5 13.7,32.5 12.7,31.5 8,31.5 6.4,29.9 JP4.23
A11  (via drill 0.25)
  Top 0.152: v42.5,33.3 42.5,33.2 42.3,33 42.3,32.4 FPGA.11 | v32,30.5 31.8,30.5 29.2,33.1 16.1,33.1 v14.1,31.1
  Bottom 0.152: v42.5,33.3 42.5,32.3 40.7,30.5 v32,30.5 | v14.1,31.1 13.8,31.1 7.4,24.7 7.4,24.4 6.2,23.2 4.9,23.2 3.9,22.2 JP4.18
A12  (via drill 0.25)
  Top 0.152: v38.3,29.9 38.4,30 40.8,30 42.7,31.9 42.7,32.3 FPGA.12
  Route15 0.152: v38.3,29.9 38.3,29.6 36.6,27.9 32.9,27.9 32,28.8 v31.1,28.8 | v32.4,26.6 31.1,26.6 30.4,27.3 29.6,27.3 27.5,29.4 v27.5,29.5 | v20,26.8 13.2,26.8 13,27 7.5,27 6.2,25.7 4.8,25.7 3.9,24.8 JP4.20
  Bottom 0.152: v31.1,28.8 32,28.8 32.4,28.4 v32.4,26.6 | v27.5,29.5 25.4,29.5 25.3,29.4 22.9,29.4 20.3,26.8 v20,26.8
A13  (via drill 0.25)
  Top 0.152: v37.4,29.4 40.7,29.4 43.2,31.9 43.2,32.3 FPGA.13 | v29.9,31.7 28.8,32.8 18.5,32.8 v15.1,29.4
  Route15 0.152: v37.4,29.4 37.4,29.1 36.5,28.2 33.4,28.2 v29.9,31.7 | v15.1,29.4 14.2,29.4 12.2,27.4 7.6,27.4 6.7,28.3 4.9,28.3 3.9,27.3 JP4.22
A14  (via drill 0.25)
  Top 0.152: v43.7,31.5 43.7,32.3 FPGA.14 | v33.2,30 29.8,33.4 v14.8,33.4
  Bottom 0.152: v43.7,31.5 42.1,31.5 40,29.4 38.1,29.4 37.3,30.2 33.4,30.2 v33.2,30 | v14.8,33.4 12.7,33.4 12.4,33.1 8.5,33.1 6.2,30.8 4.8,30.8 JP4.24
AIN1  (via drill 0.25)
  Top 0.152: v38.2,33.3 38.2,32.4 FPGA.3 | v74.5,52.9 70.5,56.9 70.5,57.2 69.8,57.9 64.3,57.9 v63.5,58.7
  Route15 0.152: 37.75,33.75 36.6,34.9 21.6,34.9 6.4,50.1 JP4.39 | 37.75,33.75 v38.2,33.3 | v74.5,52.9 132.6,52.9 137.2,57.5 146.6,57.5 148.1,59 149.2,59 JP3.6 | v57.8,49.3 53.4,49.3 43.6,39.5 v43.6,37.6 | v37.8,35.1 37.8,33.8 37.75,33.75
  Bottom 0.152: JP3.6 149.3,59.1 153.3,59.1 154.3,60.1 156.1,60.1 157.1,59.1 JP2.6 | v63.5,58.7 63.5,55 v57.8,49.3 | v43.6,37.6 42.2,36.2 38.2,36.2 37.8,35.8 v37.8,35.1
CGAIN1
  Top 0.152: 96.1,5 97.1,5 97.9,5.8 CGAIN1_1.2 98,5.8 98,8.9 RG1_1.1 | 96.1,5 95.1,5 GSW1.3 | 96.1,5 98.1,3 CGN1.2
CGAIN2
  Top 0.152: GSW1.1 95.1,3 96.8,3 97.6,2.2 103.3,2.2 104.1,3 CGN2.2 104.2,3 104.4,3.2 104.4,8.8 RG2_1.1
CGAIN5
  Bottom 0.152: 96.1,6 97.1,6 97.9,5.2 | 96.1,6 95.1,6 GSW3.3 | 96.1,6 98.1,8 CGN4.2 | 97.9,5.2 97.9,2.3 RG1_3.1 | 97.9,5.2 CGAIN1_3.2
CGAIN6
  Bottom 0.152: GSW3.1 95.1,8 96.8,8 97.6,8.8 103.3,8.8 104.1,8 CGN3.2 104.2,8 104.2,2.3 RG2_3.1
CGAIN9
  Top 0.152: 89.1,15 90.1,15 90.9,15.8 | 89.1,15 88.1,15 GSW5.3 | 89.1,15 91.1,13 CGN5.1 | 90.9,15.8 90.9,18.8 RG3_5.1 | 90.9,15.8 CGAIN1_5.2
CGAIN10
  Top 0.152: GSW5.1 88.1,13 89.8,13 90.6,12.2 96.3,12.2 97.1,13 CGN8.2 97.2,13 97.2,18.8 RG4_5.1
CGAIN11
  Bottom 0.152: 89.1,16 90.1,16 90.9,15.2 | 89.1,16 88.1,16 GSW6.3 | 89.1,16 91.1,18 CGN6.1 | 90.9,15.2 90.9,12.9 RG3_6.1 | 90.9,15.2 CGAIN1_6.2
CGAIN12
  Bottom 0.152: 92,18.8 96.3,18.8 97.1,18 CGN7.2 | 92,18.8 90.6,18.8 89.8,18 88.1,18 GSW6.1 | RG4_6.1 94.5,12.9 93.5,11.9 92,11.9 91.8,12.1 91.8,17.3 92,17.5 92,18.8
CGAIN17
  Top 0.152: 89.1,25 90.1,25 90.9,25.8 CGAIN1_9.2 91,25.8 91,28.9 RG1_5.1 | 89.1,25 88.1,25 GSW9.3 | 89.1,25 91.1,23 CGN10.2
CGAIN18
  Top 0.152: 92,22.2 96.3,22.2 97.1,23 CGN9.2 | 92,22.2 90.6,22.2 89.8,23 88.1,23 GSW9.1 | RG2_5.1 94.7,28.8 93.6,29.9 92.1,29.9 91.9,29.7 91.9,26.4 91.8,26.3 91.8,23.7 92,23.5 92,22.2
CGAIN19
  Bottom 0.152: 89.1,26 90.1,26 90.9,25.2 | 89.1,26 88.1,26 GSW10.3 | 89.1,26 91.1,28 CGN22.2 | 90.9,25.2 90.9,22.3 RG1_6.1 | 90.9,25.2 CGAIN1_10.2
CGAIN20
  Bottom 0.152: 92,28.8 96.3,28.8 97.1,28 CGN21.2 | 92,28.8 90.6,28.8 89.8,28 88.1,28 GSW10.1 | RG2_6.1 94.5,22.3 93.5,21.3 92,21.3 91.8,21.5 91.8,27.3 92,27.5 92,28.8
CGAIN21
  Top 0.152: 89.1,35 90.1,35 90.9,35.8 | 89.1,35 88.1,35 GSW11.3 | 89.1,35 91.1,33 CGN11.1 | 90.9,35.8 90.9,38.8 RG3_3.1 | 90.9,35.8 CGAIN1_11.2
CGAIN22
  Top 0.152: GSW11.1 88.1,33 89.8,33 90.6,32.2 96.3,32.2 97.1,33 CGN12.1 97.2,33 97.2,38.8 RG4_3.1
CGAIN23
  Bottom 0.152: 89.1,36 90.1,36 90.9,35.2 | 89.1,36 88.1,36 GSW12.3 | 89.1,36 91.1,38 CGN23.1 | 90.9,35.2 90.9,32.9 RG3_4.1 | 90.9,35.2 CGAIN1_12.2
CGAIN24
  Bottom 0.152: 92,38.8 96.3,38.8 97.1,38 CGN24.1 | 92,38.8 90.6,38.8 89.8,38 88.1,38 GSW12.1 | RG4_4.1 94.7,32.9 93,31.2 92.6,31.2 91.8,32 91.8,37.3 92,37.5 92,38.8
CGAIN25
  Top 0.152: 89.1,45 90.1,45 90.9,45.8 CGAIN1_13.2 91,45.8 91,48.9 RG1_7.1 | 89.1,45 88.1,45 GSW13.3 | 89.1,45 91.1,43 CGN14.2
CGAIN26
  Top 0.152: 92,42.2 96.3,42.2 97.1,43 CGN13.2 | 92,42.2 90.6,42.2 89.8,43 88.1,43 GSW13.1 | RG2_7.1 94.7,48.8 93.6,49.9 92.1,49.9 91.9,49.7 91.9,46.4 91.8,46.3 91.8,43.7 92,43.5 92,42.2
CGAIN27
  Bottom 0.152: 89.1,46 90.1,46 90.9,45.2 | 89.1,46 88.1,46 GSW14.3 | 89.1,46 91.1,48 CGN26.2 | 90.9,45.2 90.9,42.3 RG1_8.1 | 90.9,45.2 CGAIN1_14.2
CGAIN28
  Bottom 0.152: 92,48.8 96.3,48.8 97.1,48 CGN25.2 | 92,48.8 90.6,48.8 89.8,48 88.1,48 GSW14.1 | RG2_8.1 94.5,42.3 93.5,41.3 92,41.3 91.8,41.5 91.8,47.3 92,47.5 92,48.8
CGAIN29
  Top 0.152: 89.1,55 90.1,55 90.9,55.8 | 89.1,55 88.1,55 GSW15.3 | 89.1,55 91.1,53 CGN15.1 | 90.9,55.8 90.9,58.8 RG3_7.1 | 90.9,55.8 CGAIN1_15.2
CGAIN30
  Top 0.152: GSW15.1 88.1,53 89.8,53 91.4,51.4 95.5,51.4 97.1,53 CGN16.1 97.2,53 97.2,58.8 RG4_7.1
CGAIN31
  Bottom 0.152: 89.1,56 90.1,56 90.9,55.2 | 89.1,56 88.1,56 GSW16.3 | 89.1,56 91.1,58 CGN27.1 | 90.9,55.2 90.9,52.9 RG3_8.1 | 90.9,55.2 CGAIN1_16.2
CGAIN32
  Bottom 0.152: CGN28.1 97.1,58 96.3,58.8 90.6,58.8 89.8,58 88.1,58 GSW16.1 88,57.9 87.4,57.9 86.7,57.2 86.7,56.8 86.9,56.6 86.9,55.1 90.6,51.4 93,51.4 94.5,52.9 RG4_8.1
CGAIN41
  Top 0.152: 90.35,65.25 90.9,65.8 CGAIN1_21.2 91,65.8 91,68.9 RG1_11.1 | 90.35,65.25 90.1,65 88.1,65 GSW21.3 | CGN18.2 94.2,63 93.4,62.2 92.3,62.2 92,62.5 92,63.6 90.35,65.25
CGAIN42
  Top 0.152: CGN17.2 88.1,63 GSW21.1 88,63.1 87.4,63.1 86.7,63.8 86.7,64.7 87.7,65.7 87.7,67.4 90.2,69.9 93.6,69.9 94.7,68.8 RG2_11.1
CGAIN43
  Bottom 0.152: 89.1,66 90.1,66 90.9,65.2 | 89.1,66 88.1,66 GSW22.3 | 89.1,66 91.1,68 CGN30.2 | 90.9,65.2 90.9,62.3 RG1_12.1 | 90.9,65.2 CGAIN1_22.2
CGAIN44
  Bottom 0.152: 92,68.8 96.3,68.8 97.1,68 CGN29.2 | 92,68.8 90.6,68.8 89.8,68 88.1,68 GSW22.1 | RG2_12.1 94.5,62.3 93.5,61.3 92,61.3 91.8,61.5 91.8,65.9 91.3,66.4 91.3,66.8 92,67.5 92,68.8
CGAIN45
  Top 0.152: 96.1,75 97.1,75 97.9,75.8 | 96.1,75 95.1,75 GSW23.3 | 96.1,75 98.1,73 CGN19.1 | 97.9,75.8 97.9,78.8 RG3_11.1 | 97.9,75.8 CGAIN1_23.2
CGAIN46
  Top 0.152: GSW23.1 95.1,73 96.8,73 97.6,72.2 103.3,72.2 104.1,73 CGN20.1 104.2,73 104.2,78.8 RG4_11.1
CGAIN47
  Bottom 0.152: 97.9,75.2 97.15,75.95 | 97.15,75.95 97.1,76 95.1,76 GSW24.3 | 97.15,75.95 98.1,76.9 98.1,78 CGN31.1 | 97.9,75.2 97.9,72.9 RG3_12.1 | 97.9,75.2 CGAIN1_24.2
CGAIN48
  Bottom 0.152: 104.2,72.9 103.2,71.9 97.1,71.9 94.3,74.7 94.3,75.9 93.7,76.5 93.7,77.2 94.4,77.9 95,77.9 GSW24.1 | 104.2,72.9 104.2,78 CGN32.1 | 104.2,72.9 RG4_12.1
CLKINFROMRIGHT_26  (via drill 0.25)
  Top 0.152: v49.8,37.6 49.8,32.4 FPGA.26
  Route15 0.152: v49.8,37.6 49.8,40.4 v55,45.6
  Bottom 0.152: v55,45.6 56.3,46.9 56.3,72.4 PIN_RIGHT.1
CLKOUT_32  (via drill 0.25)
  Top 0.152: v64.9,47.7 66.3,47.7 IC14.4 | v65,53.6 66,54.6 66.3,54.6 IC15.4 | v66.3,65 65.3,65 64.8,65.5 64.8,66.4 66,67.6 66.3,67.6 IC22.4 | v65.9,72.1 67.4,72.1 67.9,72.6 67.9,73 67.3,73.6 67.3,74 66.7,74.6 66.4,74.6 IC23.4 | v65.3,7.6 66.3,7.6 IC1.4 | v65.3,14.6 66.3,14.6 IC2.4 | v52.8,31.5 52.8,32.3 FPGA.32 | v65.3,27.6 66.3,27.6 IC10.4 | v65.3,34.3 65.6,34.6 66.3,34.6 IC11.4
  Route15 0.152: v65,53.6 66.3,54.9 v66.3,65 65.9,65.4 v65.9,72.1 | v65.3,32.1 v65.3,27.6 65.3,26.6 | 65.3,26.6 v65.3,26.3 | 65.3,26.6 v64.4,25.7 | v64.9,47.7 64.9,46.5 65.4,46 65.4,41.7 64.8,41.1 64.4,41.1 62.1,43.4 61.7,43.4 61.4,43.1 61.4,42.7 v64.2,39.9
  Bottom 0.152: 64.4,47.7 64.4,51.2 65.9,52.7 | 64.4,47.7 64.4,45.6 64.7,45.3 65.1,45.3 66,46.2 66.3,46.2 IC16.4 | 65.9,52.7 66.3,53.1 IC13.4 | 64.4,47.7 v64.9,47.7 | 65.9,52.7 v65,53.6 | v66.3,65 66.3,66.2 IC24.4 | v65.9,72.1 66.3,72.5 66.3,73.1 IC21.4 | 65.3,6.2 64.6,6.2 64.3,6.5 64.3,12.2 65.2,13.1 65.3,13.1 | 65.3,6.2 66.3,6.2 IC3.4 | 65.3,13.1 66.3,13.1 IC4.4 | 65.3,6.2 v65.3,7.6 | 65.3,13.1 v65.3,14.6 64.6,15.3 64.6,25.5 v64.4,25.7 | v52.8,31.5 53.3,31.5 55,33.2 65.3,33.2 | 65.3,33.2 66.3,33.2 IC9.4 66.3,33.1 v65.3,32.1 | v65.3,26.3 66.3,26.3 IC12.4 | 65.3,33.2 v65.3,34.3 65.3,39 64.4,39.9 v64.2,39.9
CLKOUT_33  (via drill 0.25)
  Top 0.152: v67.4,72.8 66.4,72.8 IC23.6 | v65.3,65.8 66.3,65.8 IC22.6 | v64.9,45.8 66.3,45.8 IC14.6 | v66.3,52.1 66.3,52.7 IC15.6 | v64.8,6.7 65.7,5.8 66.3,5.8 IC1.6 | v65.3,12.5 65.5,12.7 66.3,12.7 IC2.6 | v53.9,31.4 53.7,31.4 53.3,31.8 53.3,32.3 FPGA.33 | v65.6,25 66.3,25.7 IC10.6 | v66.3,32.1 66.3,32.4 | 66.3,32.4 66.3,32.7 IC11.6 | 66.3,32.4 67.2,33.3 67.2,34.2 67.4,34.4 v67.4,35 67.4,39.5 64.9,42 v64.9,42.6
  Route15 0.152: v65.3,12.5 65.3,13.9 64.8,14.4 64.8,15.1 v65.2,15.5 | v64.9,42.6 v64.9,45.8
  Bottom 0.152: IC21.6 66.4,75 66.7,75 67.2,74.5 67.2,74 67.4,73.8 v67.4,72.8 66.3,71.7 66.2,71.7 66,71.5 66,68.1 | 66,68.1 65.3,67.4 v65.3,65.8 65.3,64.7 64.1,63.5 64.1,57.3 66.3,55.1 IC13.6 66.4,55 66.7,55 67.2,54.5 67.2,52.8 66.3,51.9 | 66,68.1 66.3,68.1 IC24.6 66,68.1 | v64.9,45.8 64.9,47 66,48.1 | 66,48.1 66.3,48.1 IC16.6 66,48.1 | 66.3,51.9 66.3,51.8 66,51.5 66,48.1 | 66.3,51.9 v66.3,52.1 | v64.8,6.7 64.8,7.8 65.1,8.1 65.3,8.1 | 65.3,8.1 66.3,8.1 IC3.6 | 65.3,8.1 v65.3,12.5 | v53.9,31.4 55.4,29.9 64.1,29.9 | 64.1,29.9 64.6,29.9 65.75,28.75 | 65.75,28.75 66.3,28.2 IC12.6 | 65.55,15.85 64.9,16.5 64.9,25 | 65.55,15.85 66.3,15.1 IC4.6 | 64.9,25 64.9,26 64.8,26.1 64.8,27.8 65.75,28.75 | 64.9,25 v65.6,25 | 64.1,29.9 v66.3,32.1 | v67.4,35 66.4,35 IC9.6 | 65.55,15.85 v65.2,15.5
CLKOUTTOLEFT_29  (via drill 0.25)
  Top 0.152: v50.9,29.4 51.2,29.7 51.2,32.3 FPGA.29
  Bottom 0.152: v50.9,29.4 47.9,26.4 47.9,14.2 52.2,9.9 52.2,4.1 PIN_LEFT.8
CONF  (via drill 0.25)
  Top 0.152: v34.2,37.8 34.6,37.4 35.2,37.4 FPGA.138 | v19.4,15.6 19.4,15.1 19.9,14.6 RS7.2
  Route15 0.152: v21.6,31.3 21.6,28.7 20.7,27.8 20.7,22 20,21.3 19.7,21.3 19.2,20.8 19.2,15.8 v19.4,15.6
  Bottom 0.152: v34.2,37.8 33.5,37.8 33,38.3 28.6,38.3 v21.6,31.3
CONFIG_SEL  (via drill 0.25)
  Top 0.152: v37.9,43.4 35.3,43.4 FPGA.126 | v25.7,39.1 25.7,38.7 26.4,38 26.4,37.6 25.2,36.4 16.9,36.4 v13.2,32.7 | v3.1,28.2 3.1,28 1.9,26.8 1.9,22.7 3.9,20.7 7.4,20.7 13.4,14.7 RS6.2
  Route15 0.152: v13.2,32.7 12.8,32.7 12.5,33 11,33 6.6,28.6 3.5,28.6 v3.1,28.2
  Bottom 0.152: v37.9,43.4 34.1,43.4 32.3,45.2 30.6,45.2 25.7,40.3 v25.7,39.1
D0A  (via drill 0.25)
  Top 0.152: v59,36.7 59,38.1 57.8,39.3 56.8,39.3 FPGA.47 | v64.8,8.5 64.8,7.4 65.5,6.7 IC1.5
  Route15 0.152: v59,36.7 59,36.5 58.8,36.3 58.8,24.3 58.1,23.6 58.1,19 64.8,12.3 v64.8,8.5
D0B
  Top 0.152: IC14.5 65.1,46.7 63.8,45.4 56.8,45.4 FPGA.59
D0C  (via drill 0.25)
  Top 0.152: v53.9,53 54.2,53.3 54.2,53.8 FPGA.74 | v51.8,50.9 51.8,43.9 44.8,36.9 v44.8,33.6 | v30.3,2.8 30,2.8 27.9,0.7 7.5,0.7 6.4,1.8 JP4.1
  Route15 0.152: v51.8,50.9 v53.9,53 | v44.8,33.6 45,33.6 45.3,33.3 v45.8,33.3 | v45.8,29.6 45.8,29.3 45.1,28.6 45.1,27.5 45.8,26.8 45.8,25 33.5,12.7 31.8,12.7 29.6,10.5 29.6,3.5 v30.3,2.8
  Bottom 0.152: v45.8,33.3 45.8,31.2 45.7,31.1 45.7,29.7 v45.8,29.6
D0D  (via drill 0.25)
  Top 0.152: v48,52.6 48.7,53.3 48.7,53.8 FPGA.85
  Route2 0.152: v42.9,37.6 42.9,35 41.2,33.3 v41.2,28.6
  Route15 0.152: v48,52.6 48,49.8 42.9,44.7 v42.9,37.6 | v41.2,28.6 41.2,26.9 34.4,20.1 32.4,20.1 31.4,19.1 31.4,12.7 29.1,10.4 29.1,4.5 26.5,1.9 14.1,1.9 10.6,5.4 5.9,5.4 4.8,4.3 4.8,2.8 3.9,1.9 JP4.2
D1A  (via drill 0.25)
  Top 0.152: v55.8,39.8 55.8,39.3 56.2,38.9 56.7,38.9 FPGA.46 | v66.5,15.7 67.2,15 67.2,14.2 66.7,13.7 IC2.5
  Route15 0.152: v59.3,39.8 59.3,38.1 61.2,36.2 61.2,21 v66.5,15.7
  Bottom 0.152: v59.3,39.8 v55.8,39.8
D1B  (via drill 0.25)
  Top 0.152: v59.3,44.9 56.8,44.9 FPGA.58 | v65.1,52.8 66,53.7 IC15.5
  Route15 0.152: v59.3,44.9 59.3,47 v65.1,52.8
D1C  (via drill 0.25)
  Top 0.152: v61.3,47.7 58.2,50.8 56.8,50.8 FPGA.70 | v41.2,1 40,1 39.8,0.8 38.6,0.8 v37.6,1.8
  Route15 0.152: v61.3,47.7 61.3,44.9 v64.6,41.6 | v68.1,35.7 68.1,34.5 68.3,34.3 v68.3,28.8 | v63.8,22.2 v67.4,22.2 | v57.8,17.5 57.1,17.5 51.2,11.6 51.2,9.9 51.3,9.8 51.3,4 48.3,1 v41.2,1 | v37.6,1.8 26.8,1.8 26.6,1.6 14,1.6 10.8,4.8 6.7,4.8 6.4,4.5 JP4.3
  Bottom 0.152: v64.6,41.6 68,38.2 68,35.8 v68.1,35.7 | v68.3,28.8 67.5,28 67.5,27.6 67.3,27.4 67.3,25.3 67.4,25.2 v67.4,22.2 | v63.8,22.2 63.1,22.2 58.4,17.5 v57.8,17.5
D1D  (via drill 0.25)
  Top 0.152: v49.2,55.2 49.2,53.9 FPGA.84 | v46.7,59.1 40.3,59.1 29.8,48.6 28.7,48.6 v26.7,46.6
  Route15 0.152: v49.2,55.2 49.2,56.6 v46.7,59.1 | v26.7,46.6 26.7,46.9 25.6,48 18.2,48 v17.6,47.4 | v3.7,33.7 1.9,31.9 1.9,22.7 3.9,20.7 6.7,20.7 7.4,20 7.4,14.2 6.2,13 3.4,13 2.8,12.4 2.8,5.5 3.8,4.5 JP4.4
  Bottom 0.152: v17.6,47.4 12.5,42.3 11.5,42.3 10.6,41.4 10.6,37.7 6.6,33.7 v3.7,33.7
D2A  (via drill 0.25)
  Top 0.152: v54.9,40.4 54.9,39.7 56.2,38.4 56.7,38.4 FPGA.45
  Route15 0.152: v54.9,40.4 54.9,41.2 v55.7,42 | v59,42.1 59,41.9 58.8,41.7 58.8,38.2 60.9,36.1 60.9,20.9 66,15.8 66,15.5 66.3,15.2 67.4,15.2 67.6,15.4 68,15.4 68.3,15.1 v68.3,9.4
  Bottom 0.152: v55.7,42 57.4,42 57.5,41.9 58.8,41.9 v59,42.1 | v68.3,9.4 68.3,8.8 66.7,7.2 IC3.5
D2B  (via drill 0.25)
  Top 0.152: v57.6,44.4 56.8,44.4 FPGA.57
  Bottom 0.152: v57.6,44.4 65.6,44.4 66.9,45.7 67,45.7 67.2,45.9 67.2,46.7 66.7,47.2 IC16.5
D2C  (via drill 0.25)
  Top 0.152: v60.7,47.6 57.9,50.4 56.8,50.4 FPGA.69 | v61.3,39.8 61.3,34.6 v64.1,31.8
  Route15 0.152: v60.7,47.6 60.7,40.4 v61.3,39.8 | v55.2,30.9 54,30.9 51,27.9 v48.3,27.9 | v39,9.2 v40.6,10.8 | v11.7,5.6 10.8,5.6 9.5,6.9 6.4,6.9 JP4.5
  Bottom 0.152: v64.1,31.8 56.1,31.8 v55.2,30.9 | v48.3,27.9 48.3,27.6 46.4,25.7 46.4,16.6 v40.6,10.8 | v39,9.2 38.4,9.2 38.1,8.9 38.1,3.6 36.5,2 15.3,2 v11.7,5.6
D2D  (via drill 0.25)
  Top 0.152: v30.9,44.2 33.4,46.7 33.4,51.3 40.2,58.1 47,58.1 50.7,54.4 50.7,53.9 FPGA.81
  Route15 0.152: v30.9,44.2 30.9,42.8 v25.9,37.8 | v12.3,34 12.6,34 15.6,31 15.6,28.6 14.3,27.3 v13.4,27.3 | v8.3,9.2 7.5,9.2 6.3,8 4.9,8 3.9,7 JP4.6
  Bottom 0.152: v25.9,37.8 24.5,36.4 14.7,36.4 v12.3,34 | v13.4,27.3 12.4,27.3 8.3,23.2 v8.3,9.2
D3A  (via drill 0.25)
  Top 0.152: v51.3,33.8 55.3,37.8 56.7,37.8 FPGA.44
  Route15 0.152: v62.1,27.3 62.1,20.8 v67.2,15.7
  Bottom 0.152: v51.3,33.8 51.3,33.6 51.2,33.5 51.2,31.1 54.1,28.2 61.2,28.2 v62.1,27.3 | v67.2,15.7 67.2,14.6 66.7,14.1 IC4.5
D3B  (via drill 0.25)
  Top 0.152: v55.8,44.3 56.2,43.9 56.7,43.9 FPGA.56
  Bottom 0.152: v55.8,44.3 55.8,44.8 64.5,53.5 64.5,53.8 64.8,54.1 IC13.5
D3C  (via drill 0.25)
  Top 0.152: v60.1,36.2 60.1,39.3 64.2,43.4 65.2,43.4 65.9,42.7 67.6,42.7 67.8,42.9 67.8,44.8 67.3,45.3 67.3,47.9 67,48.2 64,48.2 62.9,47.1 60.5,47.1 58.8,48.8 56.8,48.8 FPGA.66
  Route15 0.152: v60.1,36.2 60.1,25.2 58.6,23.7 v58.6,20.2 | v57.4,18 57.1,18 50.3,11.2 50.3,4.8 50.7,4.4 50.7,3.8 48.9,2 40.3,2 v39.6,1.3
  Bottom 0.152: v58.6,20.2 58.6,19.3 57.4,18.1 v57.4,18 | v39.6,1.3 36.2,1.3 36,1.1 15.5,1.1 7.2,9.4 6.4,9.4 JP4.7
D3D  (via drill 0.25)
  Top 0.152: v51.8,55.3 51.8,53.9 FPGA.79 | v6.2,54.4 6.2,54 5.3,53.1 5.3,50.2 3.7,48.6 3.4,48.6 1.4,46.6 1.4,35.2 v2.4,34.2
  Route15 0.152: v21.8,58.6 v40.5,58.6 | v2.4,34.2 2.4,33.7 1.5,32.8 1.5,20.5 v3.7,18.3
  Bottom 0.152: v51.8,55.3 45.4,61.7 43.6,61.7 v40.5,58.6 | v21.8,58.6 20.1,60.3 10.4,60.3 10.1,60 10.1,58.3 v6.2,54.4 | v3.7,18.3 4,18.3 4.8,17.5 4.8,10.4 3.9,9.5 JP4.8
D4A  (via drill 0.25)
  Top 0.152: v53.4,33.8 53.4,34.8 55.9,37.3 56.7,37.3 FPGA.43 | v55.3,31.7 60.5,31.7 65.4,26.8 66.2,26.8 66.3,26.7 IC10.5
  Route2 0.152: v53.4,33.8 53.4,33.6 v55.3,31.7
D4B  (via drill 0.25)
  Top 0.152: v62,44.9 60.2,44.9 58.7,43.4 56.8,43.4 FPGA.55 | v67.9,65.2 67.9,65.5 66.7,66.7 IC22.5
  Route15 0.152: v62,44.9 62,49 67.9,54.9 v67.9,65.2
D4C  (via drill 0.25)
  Top 0.152: v55.8,48.8 56.2,48.4 56.7,48.4 FPGA.65
  Route15 0.152: v16.7,74 16.7,73.8 2.7,59.8 2.7,51.2 1.6,50.1 1.6,36.2 v1.9,35.9
  Bottom 0.152: v55.8,48.8 55.8,53.5 54.9,54.4 54.9,67.3 54.5,67.7 40,67.7 39.4,67.1 34.4,67.1 27.5,74 v16.7,74 | v1.9,35.9 1.9,22.7 3.9,20.7 4.2,20.7 5.3,19.6 5.3,13.1 6.3,12.1 JP4.9
D4D  (via drill 0.25)
  Top 0.152: v52.3,53 52.3,53.8 FPGA.78 | v53.6,48.8 53.6,45.3 47.6,39.3 47.6,36.3 v45.3,34 | v40.6,15.6 38,13 34.8,13 32.6,10.8 31.7,10.8 29.4,8.5 v27.6,8.5
  Route15 0.152: v27.6,8.5 27.6,8.1 27.2,7.7 27.2,5.1 24.5,2.4 15.8,2.4 7.2,11 4.9,11 3.9,12 JP4.10
  Bottom 0.152: v52.3,53 52.3,50.1 v53.6,48.8 | v45.3,34 45.3,29.4 46.1,28.6 46.1,21.1 v40.6,15.6
D5A  (via drill 0.25)
  Top 0.152: v55.8,36.5 55.9,36.4 56.7,36.4 FPGA.41 | v62.9,37 64.2,35.7 64.2,33.6 64.6,33.2 65.5,33.2 66,33.7 IC11.5
  Bottom 0.152: v55.8,36.5 57.4,36.5 57.5,36.4 58,36.4 58.8,37.2 62.7,37.2 v62.9,37
D5B  (via drill 0.25)
  Top 0.152: v55.8,43.3 56.2,42.9 56.7,42.9 FPGA.54 | v65.4,70.9 65.4,73.1 66,73.7 IC23.5
  Bottom 0.152: v55.8,43.3 55.8,43.6 55.3,44.1 55.3,44.8 57.2,46.7 57.2,62.7 v65.4,70.9
D5C  (via drill 0.25)
  Top 0.152: v55.7,48.2 56,47.9 56.7,47.9 FPGA.64 | v22.1,47.2 v26.8,51.9
  Route15 0.152: v42.7,55.3 38.3,55.3 37.3,54.3 29.2,54.3 v26.8,51.9 | v13.3,36.9 7.2,36.9 6.5,36.2 3.3,36.2 0.9,33.8 0.9,18.6 3.9,15.6 5.3,15.6 6.3,14.6 JP4.11
  Bottom 0.152: v55.7,48.2 52.8,51.1 52.8,53.2 49.3,56.7 44.1,56.7 v42.7,55.3 | v22.1,47.2 22.1,45.7 19.4,43 19,43 13.3,37.3 v13.3,36.9
D5D  (via drill 0.25)
  Top 0.152: v52.7,54.8 52.7,53.9 FPGA.77
  Route15 0.152: v42.4,57.5 42.4,58.7 42,59.1 v20.6,59.1 | v6.9,54.4 3.9,51.4 3.3,51.4 2.1,50.2 v2.1,37.1